# EasyEDA schematic SCH_Aladdin Flight Controller FC-H7_EasyEDA.json

## Sheets
1 STM32H757IIT6: TITLE: STM32H757IIT6 & Power sources; REV: 1.0; Date: 2022-08-20; Sheet: 1/6; Drawn By: Ala BENSAID
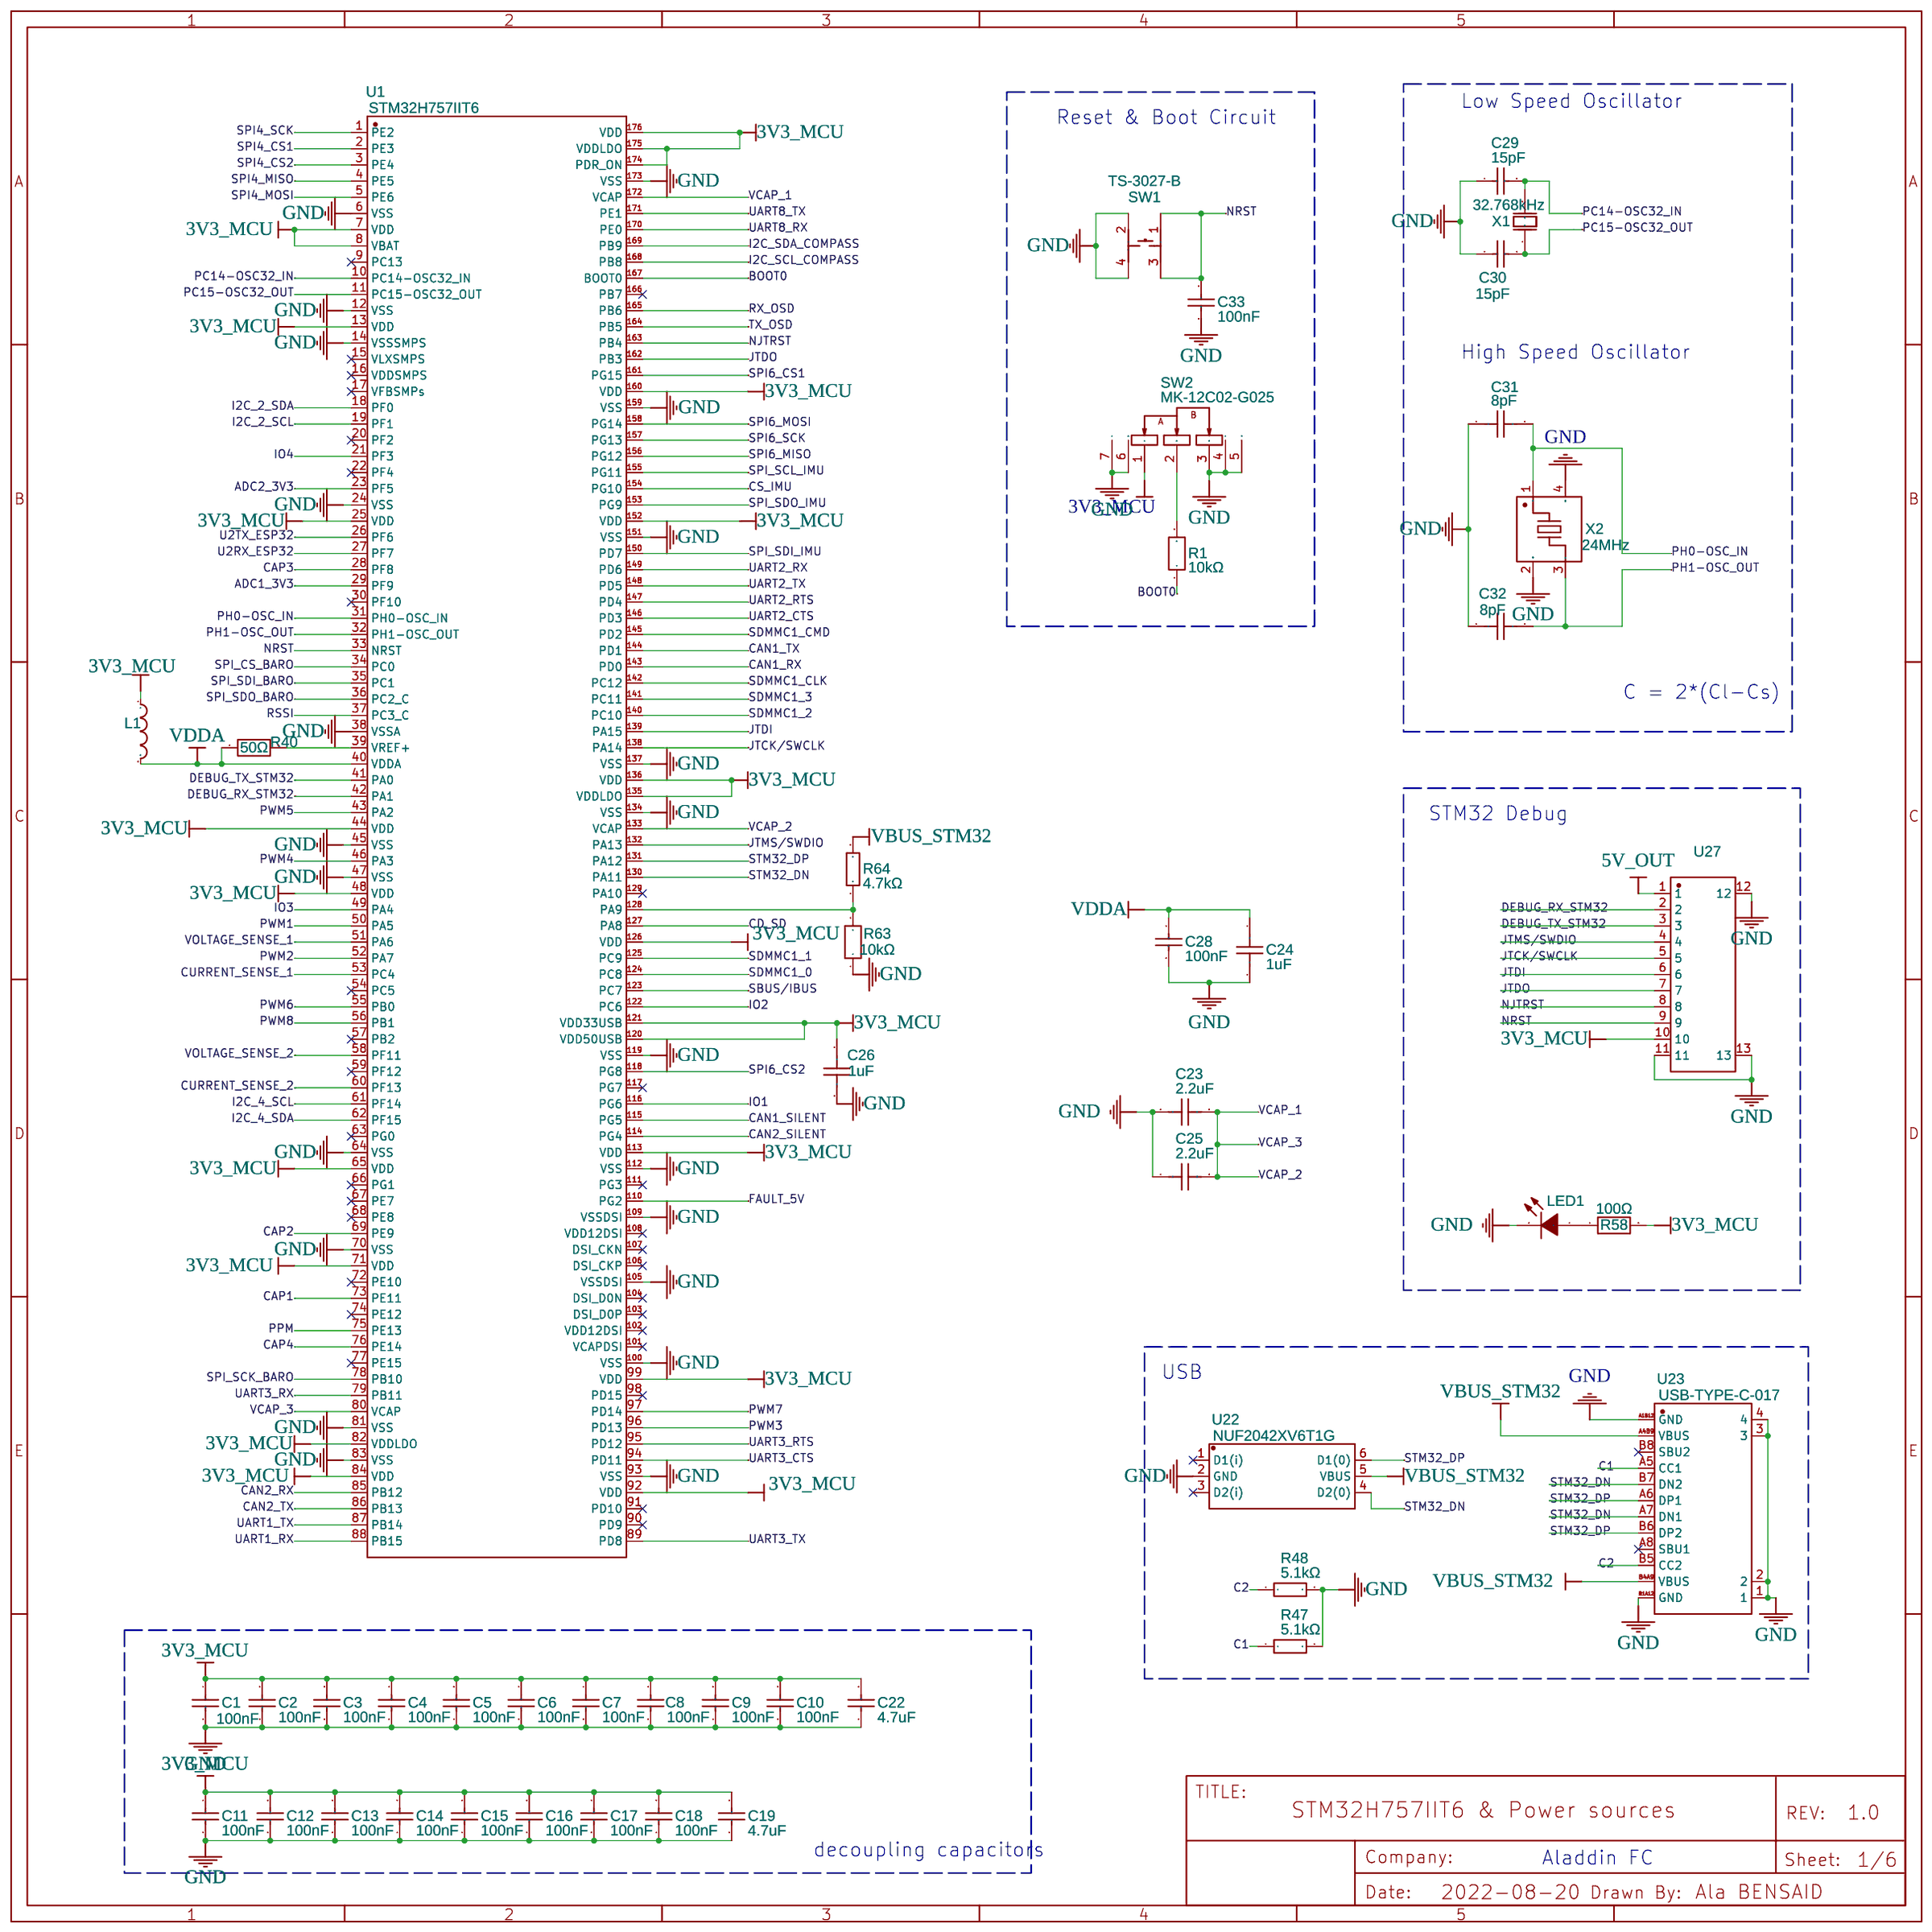
[diagram p0: STM32H757IIT6]
2 On Board Sensor: TITLE: On Board Sensor; Sheet: 2/6
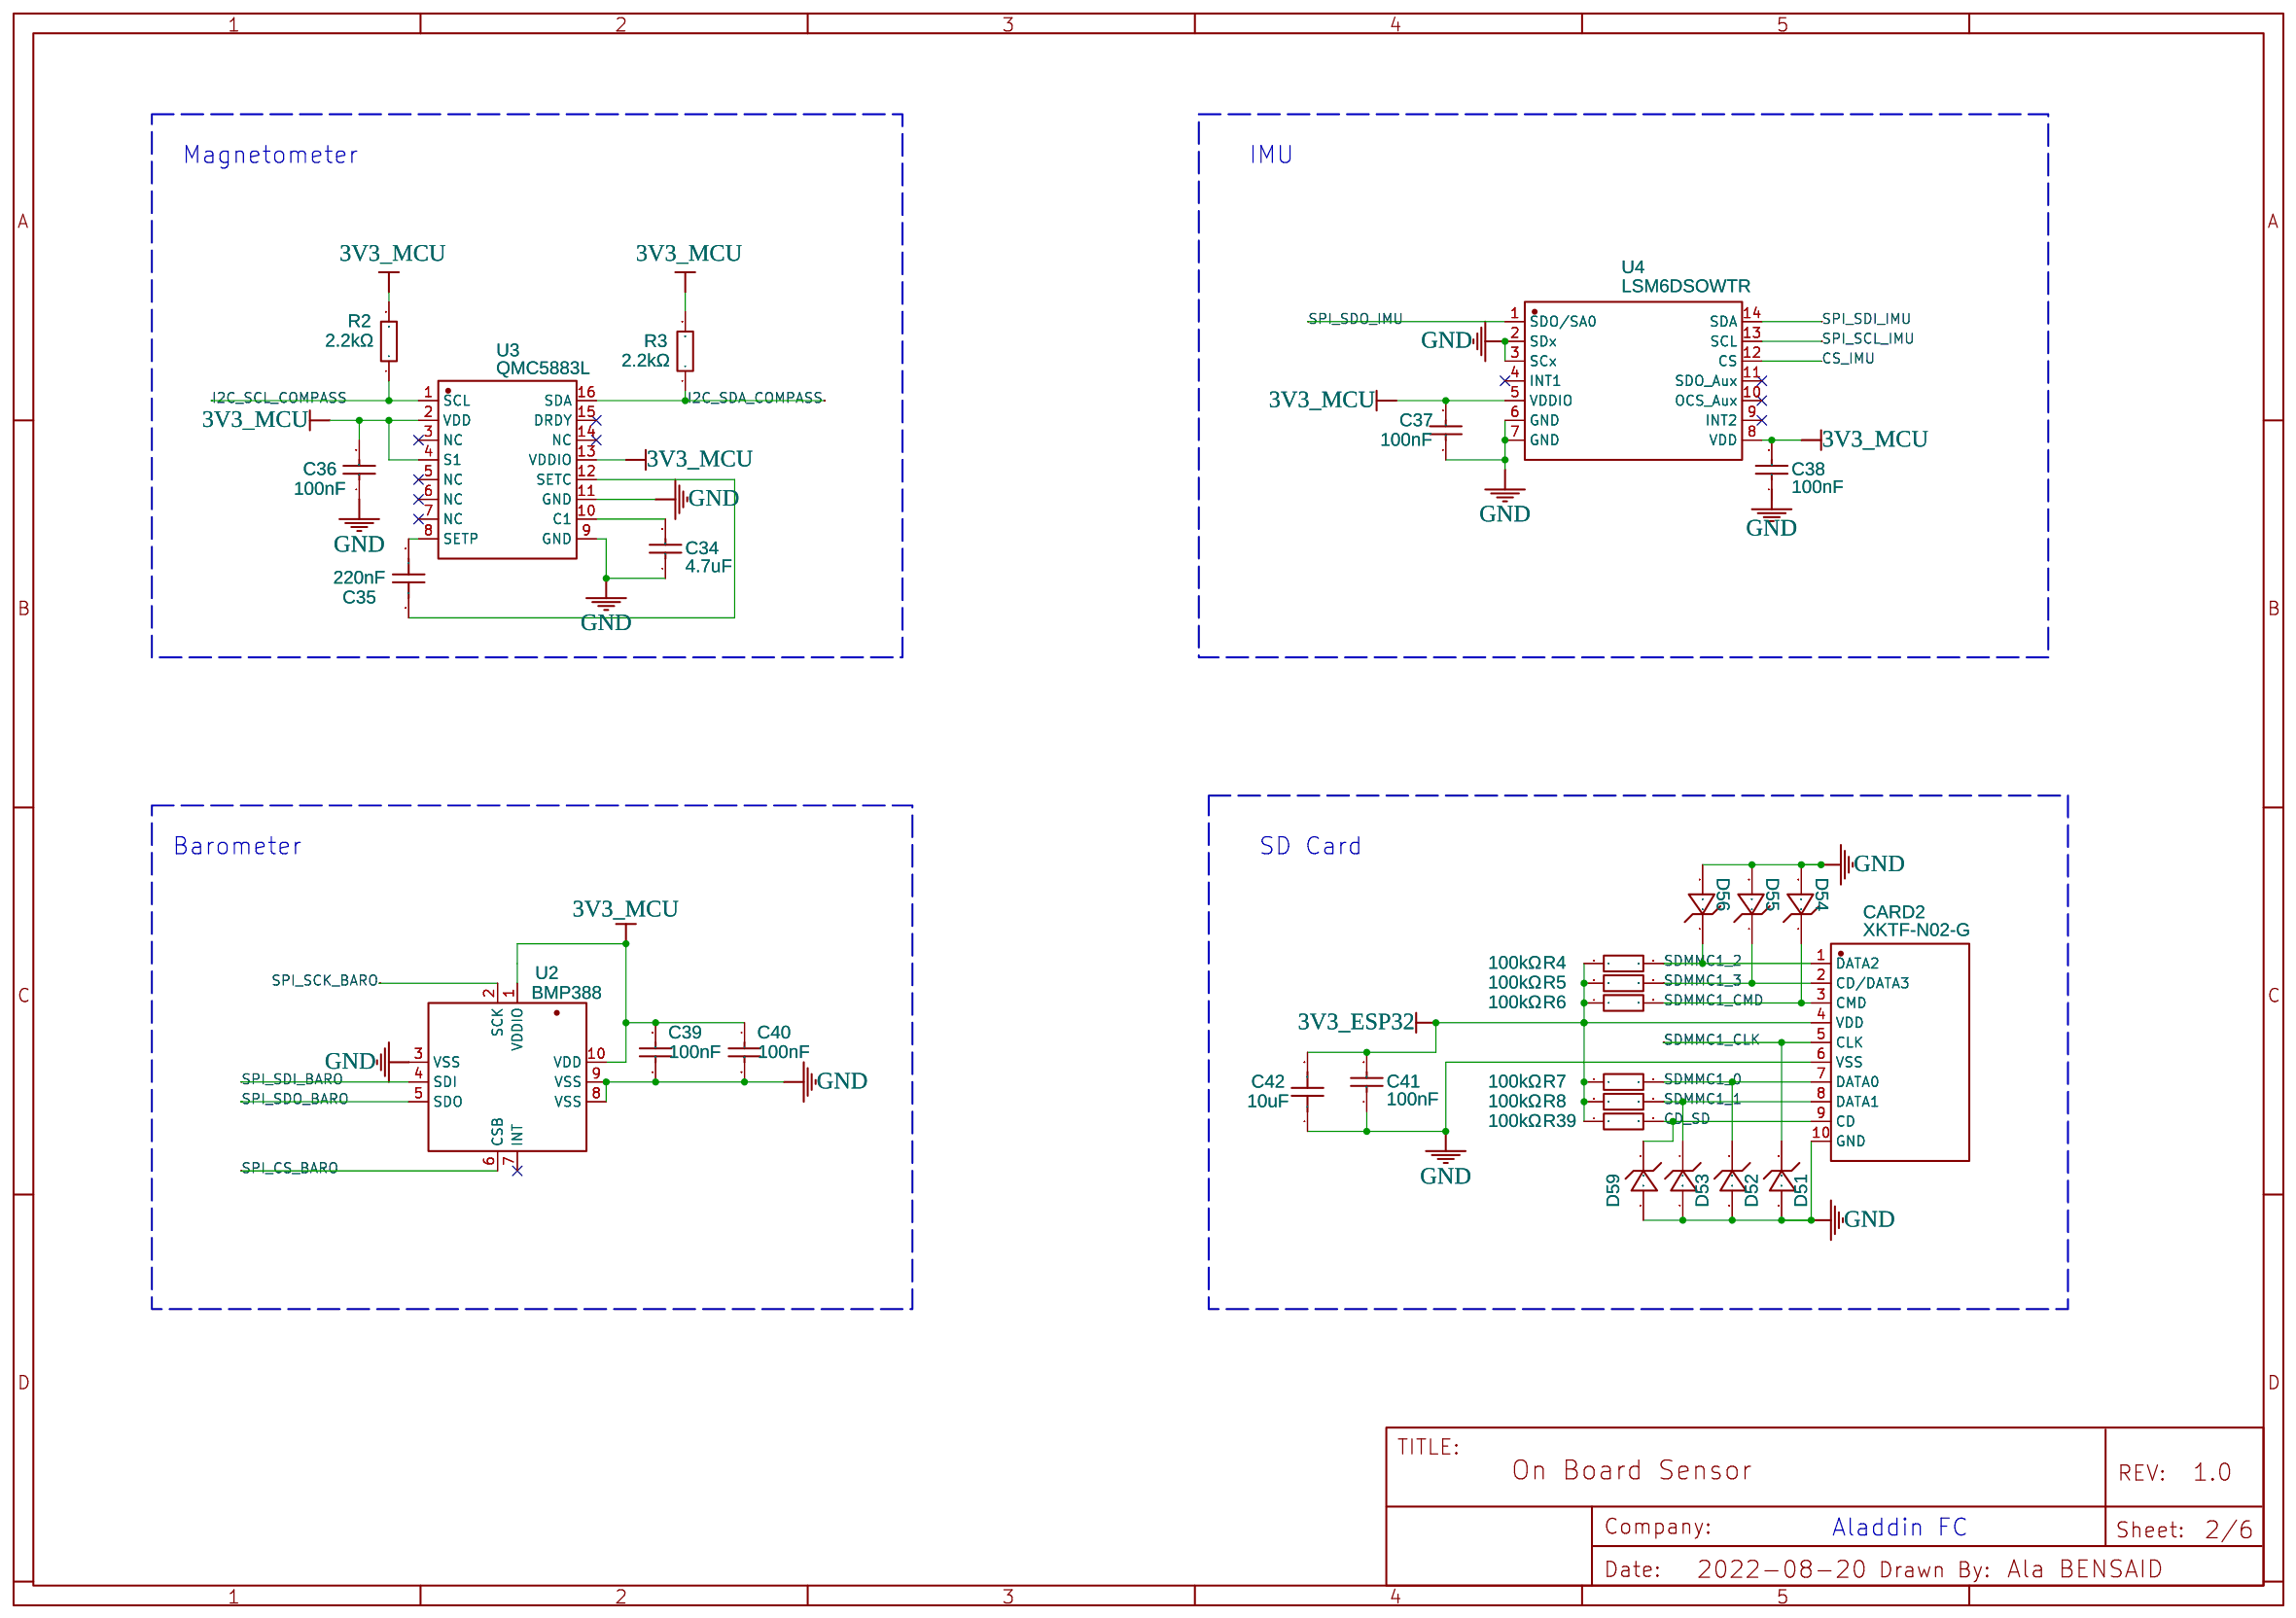
[diagram p1: On Board Sensor]
3 OSD: TITLE: OSD & Atmega328 FMU; Sheet: 3/6
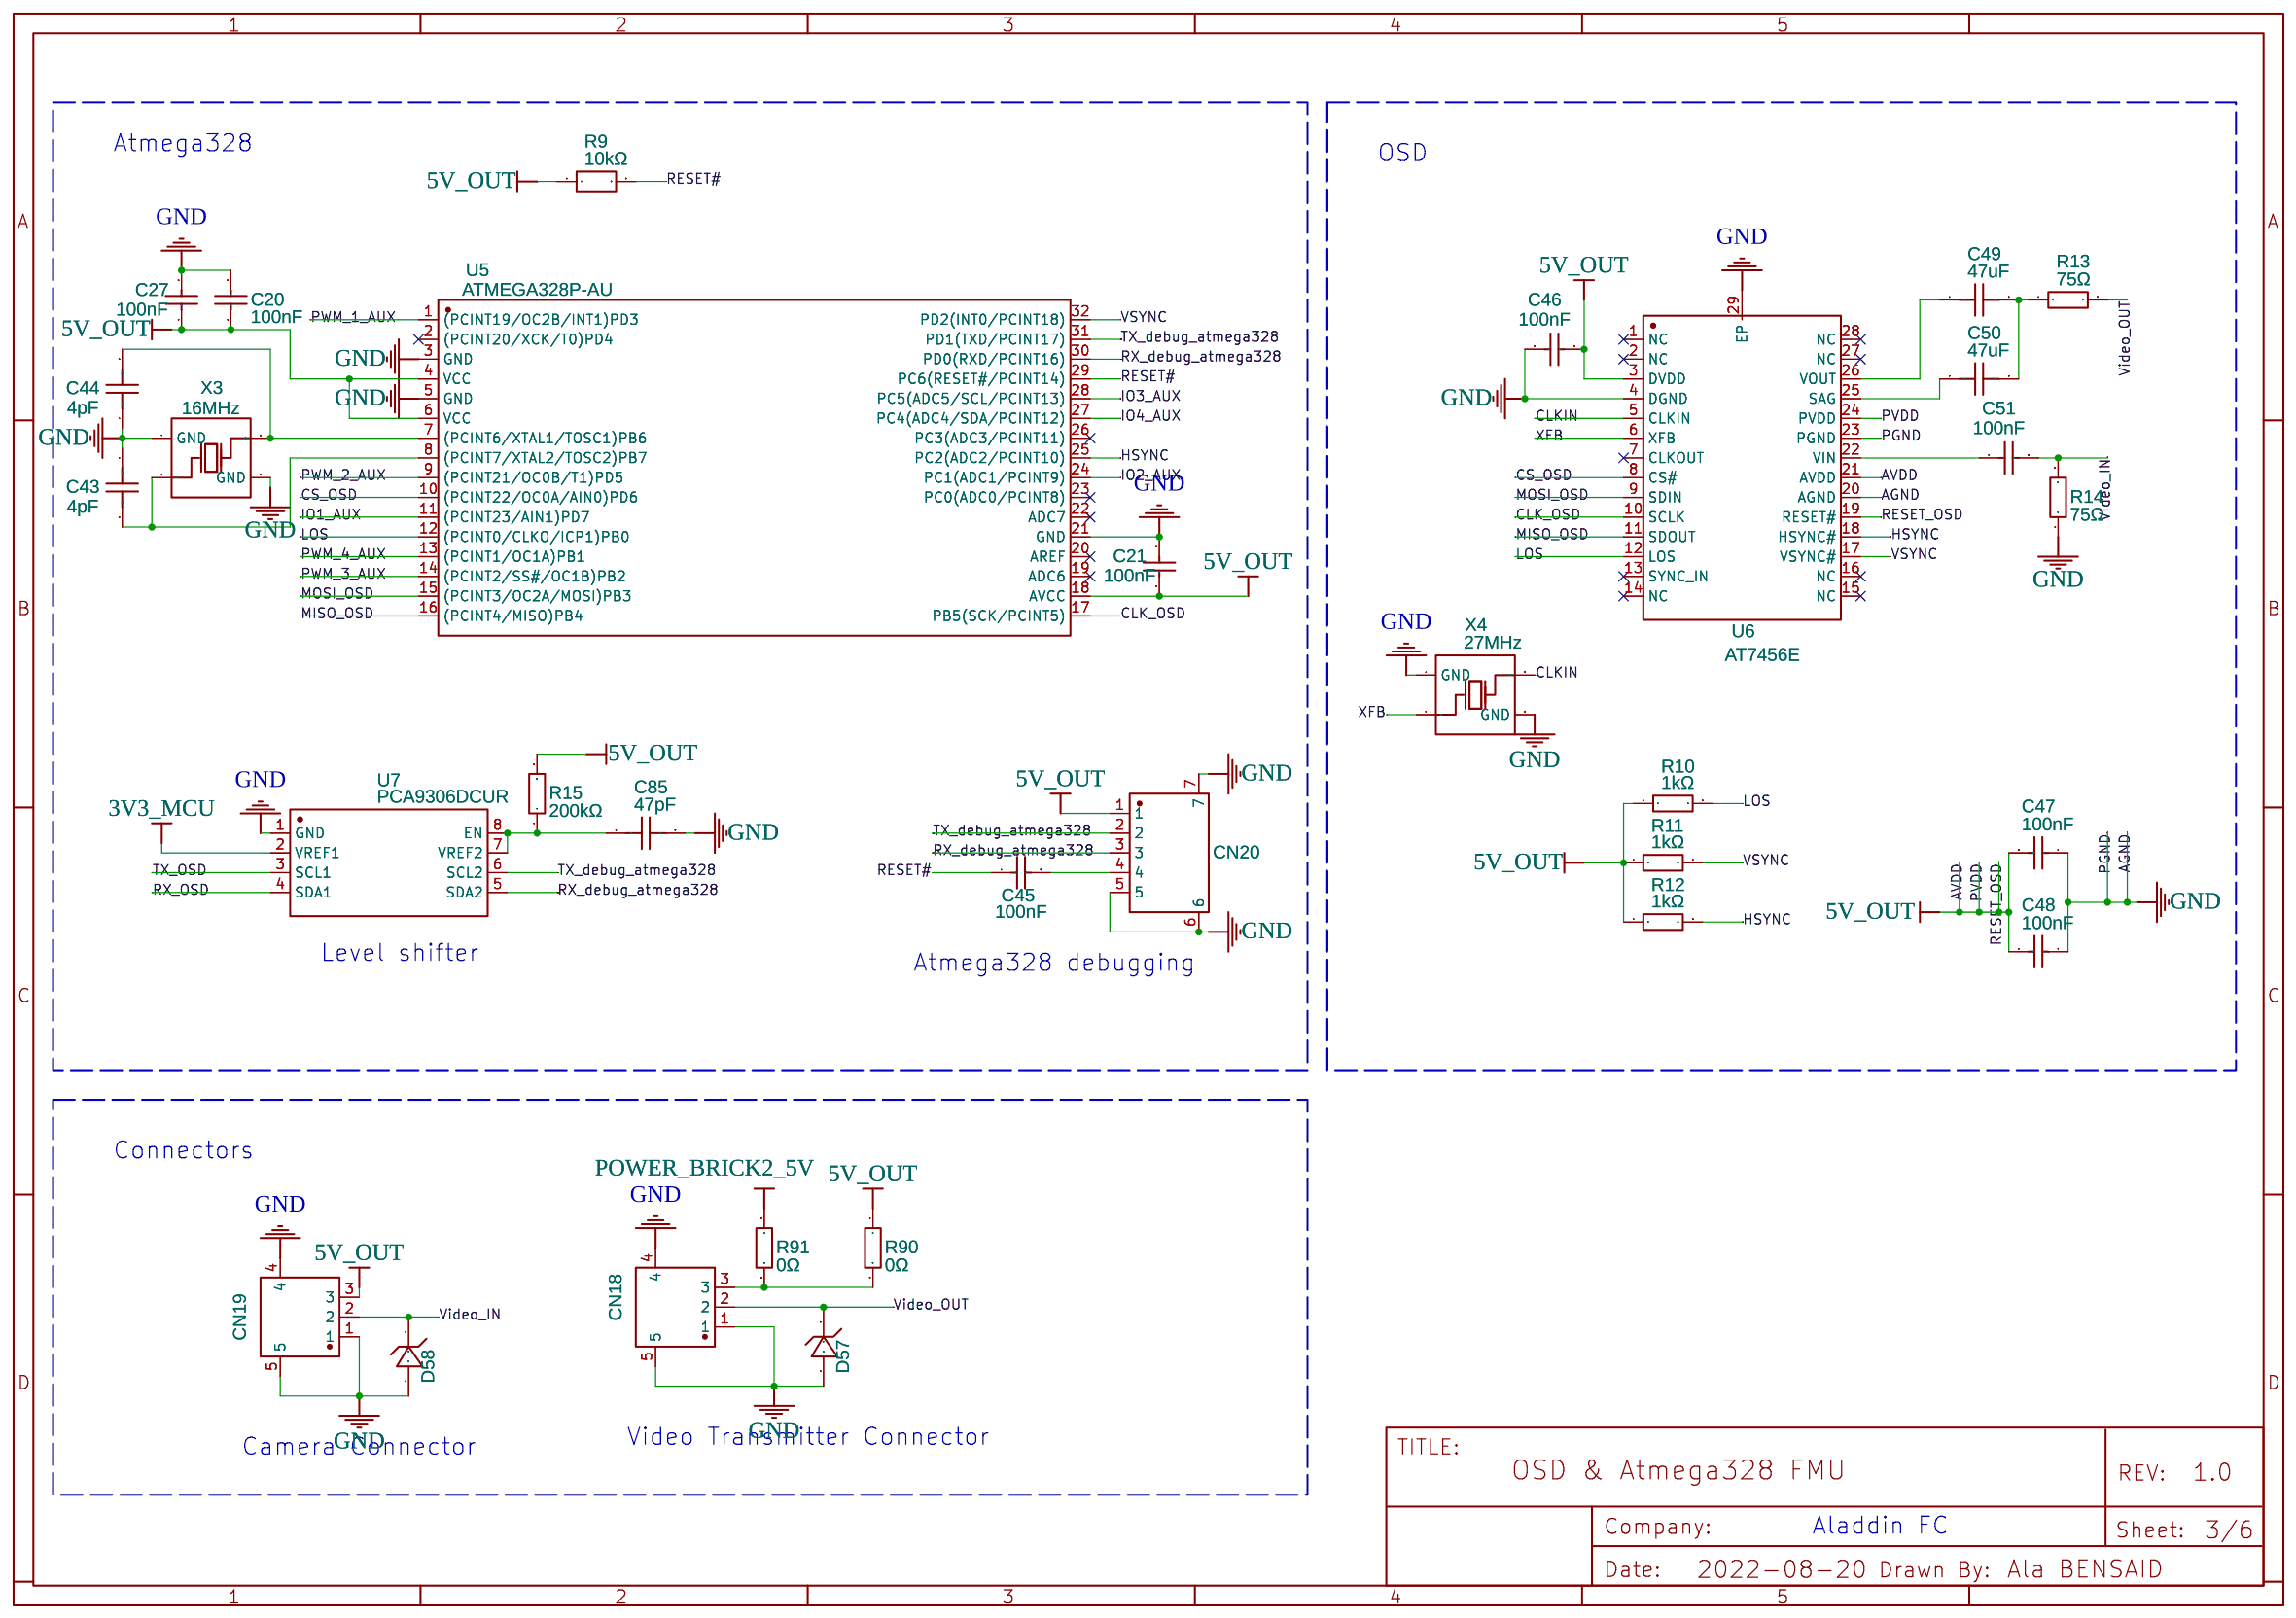
[diagram p2: OSD]
4 Connectors: TITLE: Connectors; Sheet: 4/6
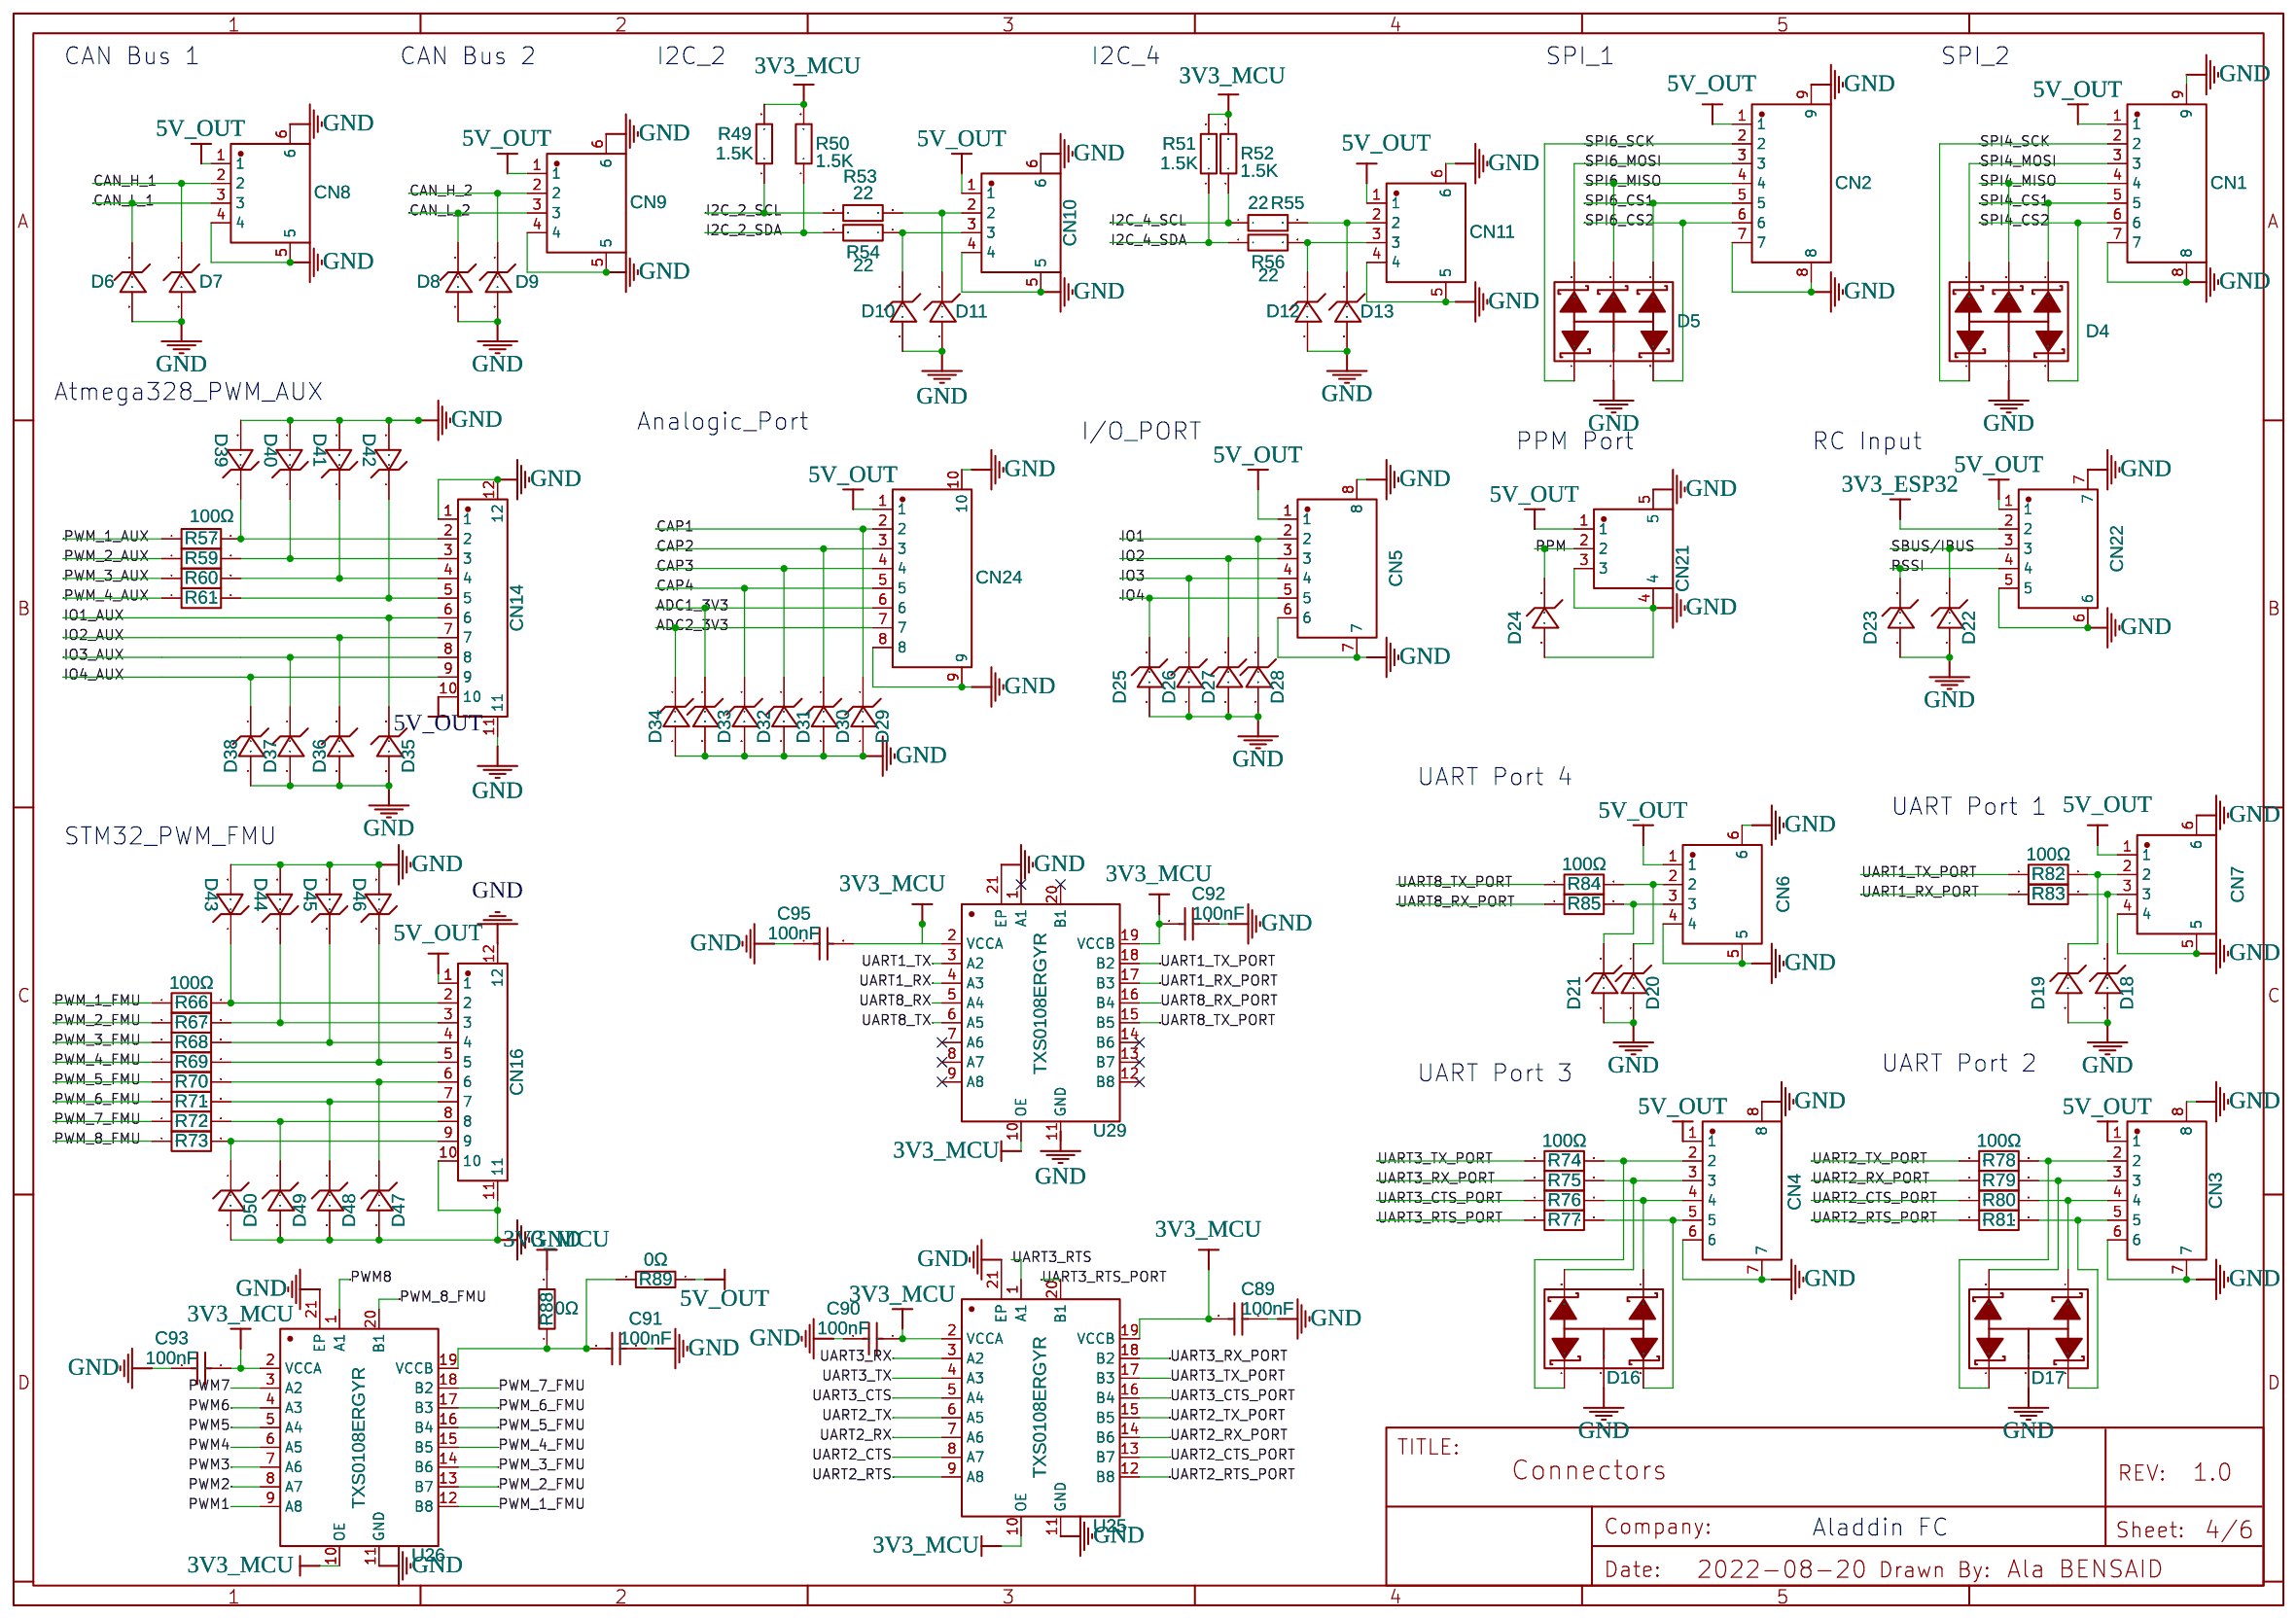
[diagram p3: Connectors]
5 WIFI ESP32: TITLE: WIFI    ESP32; Date: 2022-10-03; Sheet: 5/6
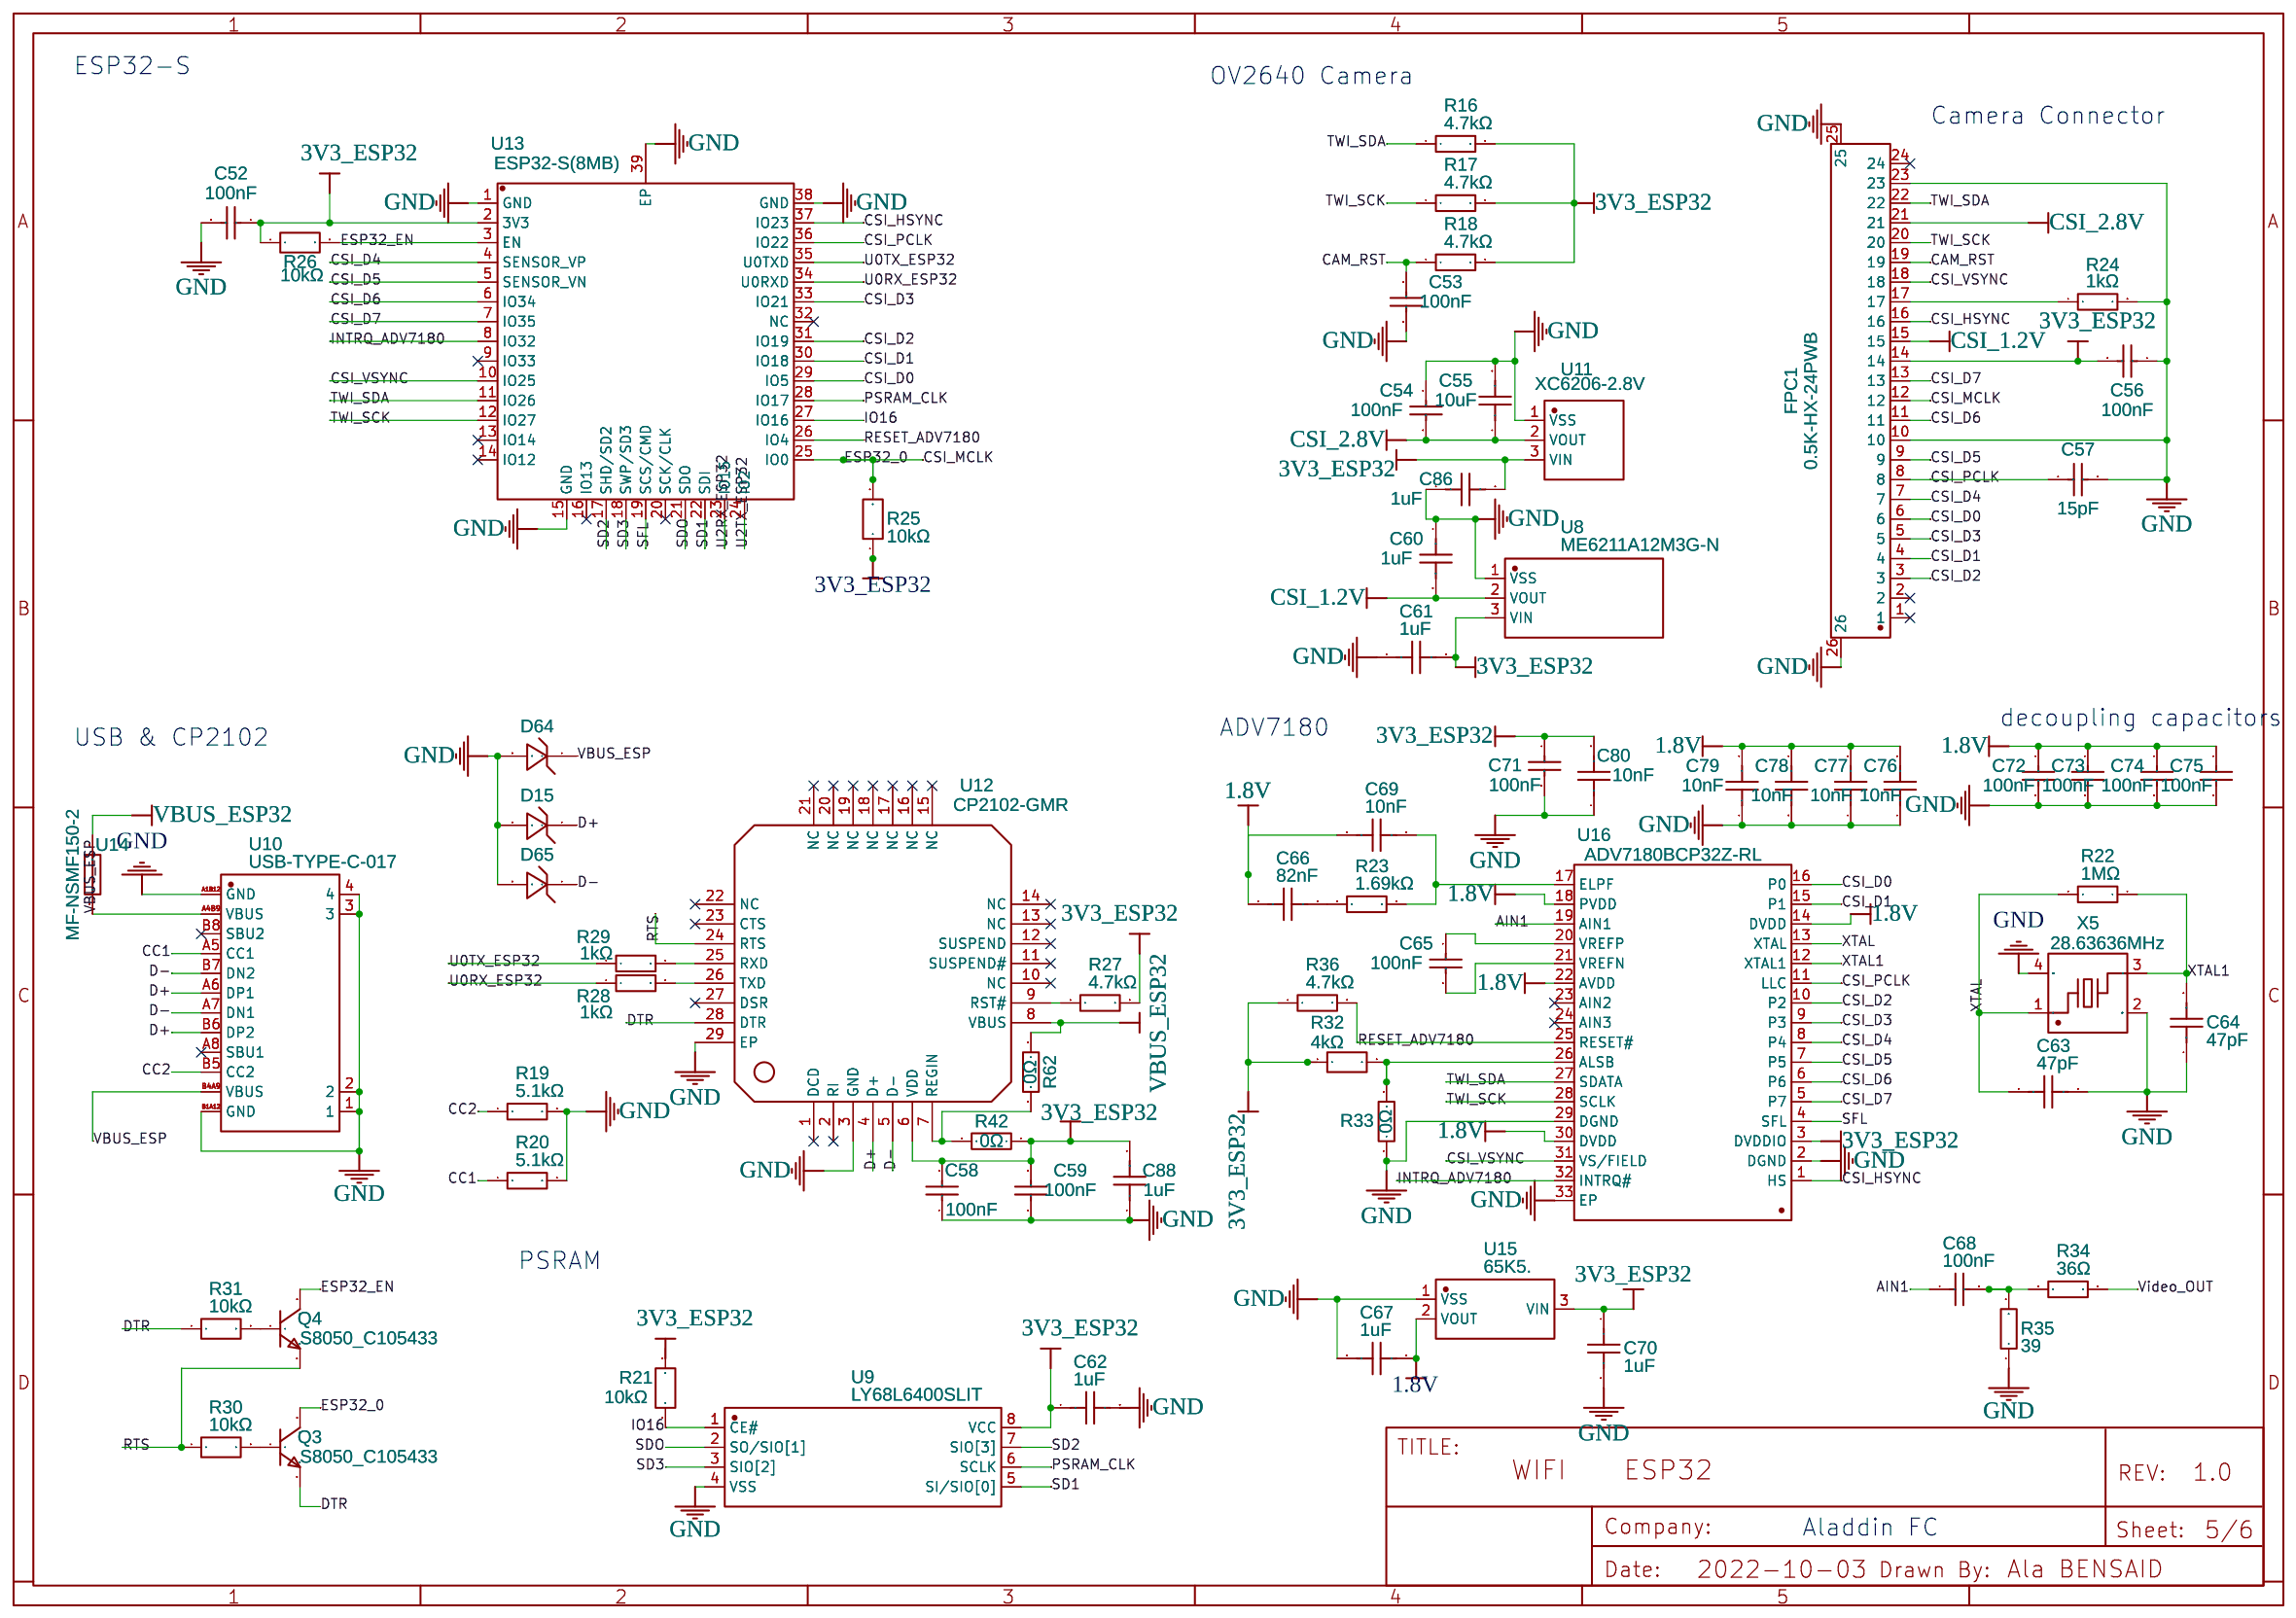
[diagram p4: WIFI ESP32]
6 Power & CAN bus: TITLE: Power & CAN bus; Date: 2022-10-29; Sheet: 6/6
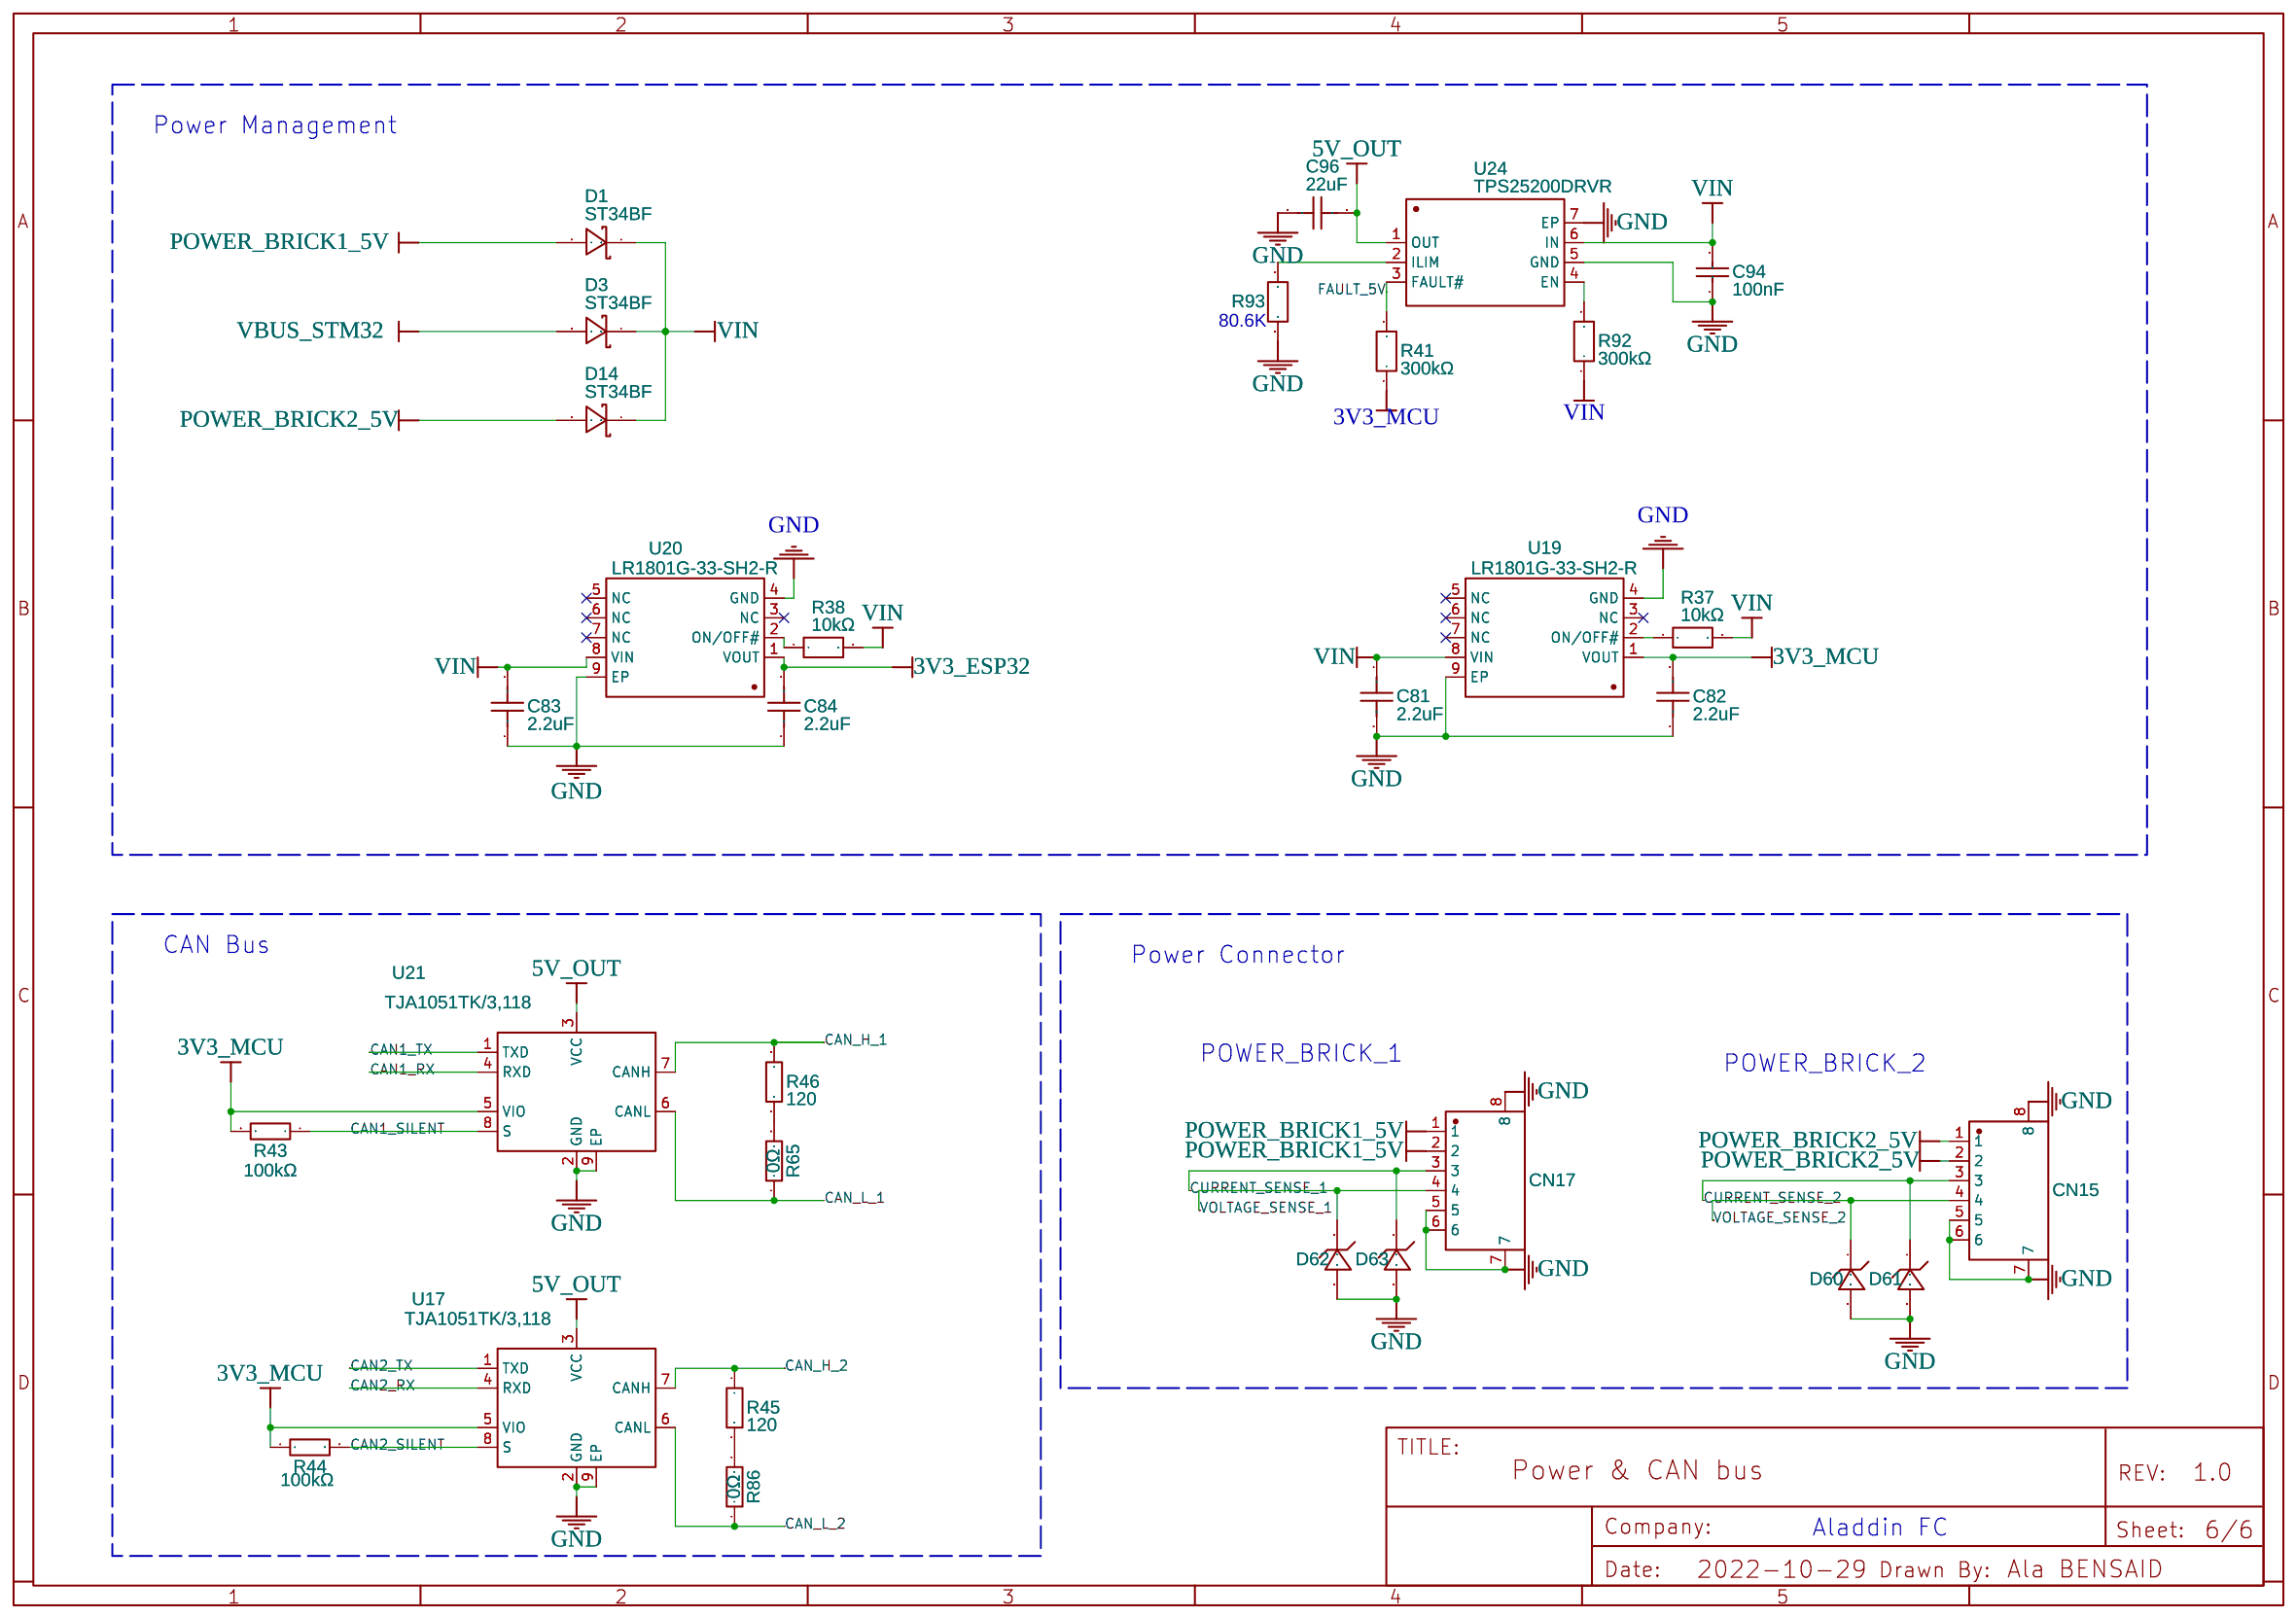
[diagram p5: Power & CAN bus]

## Parts
sheet Connectors
C89  100nF  [C0805]
C90  100nF  [C0805]
C91  100nF  [C0805]
C92  100nF  [C0805]
C93  100nF  [C0805]
C95  100nF  [C0805]
CN1  A1257WV-S-7P  [CONN-SMD_A1257WV-S-7P]
CN2  A1257WV-S-7P  [CONN-SMD_A1257WV-S-7P]
CN3  A1257WV-S-6P  [CONN-SMD_A1257WV-S-6P]
CN4  A1257WV-S-6P  [CONN-SMD_A1257WV-S-6P]
CN5  A1257WV-S-6P  [CONN-SMD_A1257WV-S-6P]
CN6  A1257WV-S-4P  [CONN-SMD_A1257WV-S-4P]
CN7  A1257WV-S-4P  [CONN-SMD_A1257WV-S-4P]
CN8  A1257WV-S-4P  [CONN-SMD_A1257WV-S-4P]
CN9  A1257WV-S-4P  [CONN-SMD_A1257WV-S-4P]
CN10  A1257WV-S-4P  [CONN-SMD_A1257WV-S-4P]
CN11  A1257WV-S-4P  [CONN-SMD_A1257WV-S-4P]
CN14  GH125-S10CCA-00  [CONN-SMD_10P-P1.25_JS_GH125-S10CCA-00]
CN16  GH125-S10CCA-00  [CONN-SMD_10P-P1.25_JS_GH125-S10CCA-00]
CN21  A1257WR-S-3P  [CONN-SMD_A1257WR-S-3P]
CN22  A1257WR-S-5P  [CONN-SMD_A1257WR-S-5P]
CN24  A1257WR-S-8P  [CONN-SMD_A1257WR-S-8P]
D4  SP1001-05JTG  [SC-70-6_L2.2-W1.3-P0.65-LS2.1-BL]
D5  SP1001-05JTG  [SC-70-6_L2.2-W1.3-P0.65-LS2.1-BL]
D6  ESD9X5V-2/TR  [FBP-02C_L1.0-W0.6-RD]
D7  ESD9X5V-2/TR  [FBP-02C_L1.0-W0.6-RD]
D8  ESD9X5V-2/TR  [FBP-02C_L1.0-W0.6-RD]
D9  ESD9X5V-2/TR  [FBP-02C_L1.0-W0.6-RD]
D10  ESD9X5V-2/TR  [FBP-02C_L1.0-W0.6-RD]
D11  ESD9X5V-2/TR  [FBP-02C_L1.0-W0.6-RD]
D12  ESD9X5V-2/TR  [FBP-02C_L1.0-W0.6-RD]
D13  ESD9X5V-2/TR  [FBP-02C_L1.0-W0.6-RD]
D16  SP1001-04JTG  [SC-70-5_L2.1-W1.3-P0.65-LS2.2-BR]
D17  SP1001-04JTG  [SC-70-5_L2.1-W1.3-P0.65-LS2.2-BR]
D18  ESD9X5V-2/TR  [FBP-02C_L1.0-W0.6-RD]
D19  ESD9X5V-2/TR  [FBP-02C_L1.0-W0.6-RD]
D20  ESD9X5V-2/TR  [FBP-02C_L1.0-W0.6-RD]
D21  ESD9X5V-2/TR  [FBP-02C_L1.0-W0.6-RD]
D22  ESD9X5V-2/TR  [FBP-02C_L1.0-W0.6-RD]
D23  ESD9X5V-2/TR  [FBP-02C_L1.0-W0.6-RD]
D24  ESD9X5V-2/TR  [FBP-02C_L1.0-W0.6-RD]
D25  ESD9X5V-2/TR  [FBP-02C_L1.0-W0.6-RD]
D26  ESD9X5V-2/TR  [FBP-02C_L1.0-W0.6-RD]
D27  ESD9X5V-2/TR  [FBP-02C_L1.0-W0.6-RD]
D28  ESD9X5V-2/TR  [FBP-02C_L1.0-W0.6-RD]
D29  ESD9X5V-2/TR  [FBP-02C_L1.0-W0.6-RD]
D30  ESD9X5V-2/TR  [FBP-02C_L1.0-W0.6-RD]
D31  ESD9X5V-2/TR  [FBP-02C_L1.0-W0.6-RD]
D32  ESD9X5V-2/TR  [FBP-02C_L1.0-W0.6-RD]
D33  ESD9X5V-2/TR  [FBP-02C_L1.0-W0.6-RD]
D34  ESD9X5V-2/TR  [FBP-02C_L1.0-W0.6-RD]
D35  ESD9X5V-2/TR  [FBP-02C_L1.0-W0.6-RD]
D36  ESD9X5V-2/TR  [FBP-02C_L1.0-W0.6-RD]
D37  ESD9X5V-2/TR  [FBP-02C_L1.0-W0.6-RD]
D38  ESD9X5V-2/TR  [FBP-02C_L1.0-W0.6-RD]
D39  ESD9X5V-2/TR  [FBP-02C_L1.0-W0.6-RD]
D40  ESD9X5V-2/TR  [FBP-02C_L1.0-W0.6-RD]
D41  ESD9X5V-2/TR  [FBP-02C_L1.0-W0.6-RD]
D42  ESD9X5V-2/TR  [FBP-02C_L1.0-W0.6-RD]
D43  ESD9X5V-2/TR  [FBP-02C_L1.0-W0.6-RD]
D44  ESD9X5V-2/TR  [FBP-02C_L1.0-W0.6-RD]
D45  ESD9X5V-2/TR  [FBP-02C_L1.0-W0.6-RD]
D46  ESD9X5V-2/TR  [FBP-02C_L1.0-W0.6-RD]
D47  ESD9X5V-2/TR  [FBP-02C_L1.0-W0.6-RD]
D48  ESD9X5V-2/TR  [FBP-02C_L1.0-W0.6-RD]
D49  ESD9X5V-2/TR  [FBP-02C_L1.0-W0.6-RD]
D50  ESD9X5V-2/TR  [FBP-02C_L1.0-W0.6-RD]
R49  1.5K  [R0805]
R50  1.5K  [R0805]
R51  1.5K  [R0805]
R52  1.5K  [R0805]
R53  22  [R0805]
R54  22  [R0805]
R55  22  [R0805]
R56  22  [R0805]
R57  100Ω  [R0603]
R59  100Ω  [R0603]
R60  100Ω  [R0603]
R61  100Ω  [R0603]
R66  100Ω  [R0603]
R67  100Ω  [R0603]
R68  100Ω  [R0603]
R69  100Ω  [R0603]
R70  100Ω  [R0603]
R71  100Ω  [R0603]
R72  100Ω  [R0603]
R73  100Ω  [R0603]
R74  100Ω  [R0603]
R75  100Ω  [R0603]
R76  100Ω  [R0603]
R77  100Ω  [R0603]
R78  100Ω  [R0603]
R79  100Ω  [R0603]
R80  100Ω  [R0603]
R81  100Ω  [R0603]
R82  100Ω  [R0603]
R83  100Ω  [R0603]
R84  100Ω  [R0603]
R85  100Ω  [R0603]
R88  0Ω  [R0805]
R89  0Ω  [R0805]
U25  TXS0108ERGYR  [VQFN-20_L4.6-W3.6-P0.50-BL-EP]
U26  TXS0108ERGYR  [VQFN-20_L4.6-W3.6-P0.50-BL-EP]
U29  TXS0108ERGYR  [VQFN-20_L4.6-W3.6-P0.50-BL-EP]
sheet On Board Sensor
C34  4.7uF  [C0805]
C35  220nF  [C0805]
C36  100nF  [C0805]
C37  100nF  [C0805]
C38  100nF  [C0805]
C39  100nF  [C0805]
C40  100nF  [C0805]
C41  100nF  [C0805]
C42  10uF  [C0805]
CARD2  XKTF-N02-G  [TF-SMD_XKTF-N02-G]
D51  ESD9X5V-2/TR  [FBP-02C_L1.0-W0.6-RD]
D52  ESD9X5V-2/TR  [FBP-02C_L1.0-W0.6-RD]
D53  ESD9X5V-2/TR  [FBP-02C_L1.0-W0.6-RD]
D54  ESD9X5V-2/TR  [FBP-02C_L1.0-W0.6-RD]
D55  ESD9X5V-2/TR  [FBP-02C_L1.0-W0.6-RD]
D56  ESD9X5V-2/TR  [FBP-02C_L1.0-W0.6-RD]
D59  ESD9X5V-2/TR  [FBP-02C_L1.0-W0.6-RD]
R2  2.2kΩ  [R0805]
R3  2.2kΩ  [R0805]
R4  100kΩ  [R0805]
R5  100kΩ  [R0805]
R6  100kΩ  [R0805]
R7  100kΩ  [R0805]
R8  100kΩ  [R0805]
R39  100kΩ  [R0805]
U2  BMP388  [SENSORM-SMD_BMP388]
U3  QMC5883L  [LGA-16_L3.0-W3.0-P0.50-BL_SQ]
U4  LSM6DSOWTR  [LGA-14L_L3.0-W2.5-P0.50-TL]
sheet OSD
C20  100nF  [C0805]
C21  100nF  [C0805]
C27  100nF  [C0805]
C43  4pF  [C0805]
C44  4pF  [C0805]
C45  100nF  [C0805]
C46  100nF  [C0805]
C47  100nF  [C0805]
C48  100nF  [C0805]
C49  47uF  [C0805]
C50  47uF  [C0805]
C51  100nF  [C0805]
C85  47pF  [C0805]
CN18  A1257WR-S-3P  [CONN-SMD_A1257WR-S-3P]
CN19  A1257WR-S-3P  [CONN-SMD_A1257WR-S-3P]
CN20  A1257WR-S-5P  [CONN-SMD_A1257WR-S-5P]
D57  ESD9X5V-2/TR  [FBP-02C_L1.0-W0.6-RD]
D58  ESD9X5V-2/TR  [FBP-02C_L1.0-W0.6-RD]
R9  10kΩ  [R0805]
R10  1kΩ  [R0805]
R11  1kΩ  [R0805]
R12  1kΩ  [R0805]
R13  75Ω  [R0805]
R14  75Ω  [R0805]
R15  200kΩ  [R0805]
R90  0Ω  [R0805]
R91  0Ω  [R0805]
U5  ATMEGA328P-AU  [TQFP-32_L7.0-W7.0-P0.80-LS9.0-BL]
U6  AT7456E  [TSSOP-28_L9.7-W4.4-P0.65-LS6.4-BL-EP-2]
U7  PCA9306DCUR  [SSOP-8_L2.0-W2.3-P0.50-LS3.1-BR]
X3  16MHz  [CRYSTAL-SMD_4P-L3.2-W2.5-BL]
X4  27MHz  [OSC-SMD_4P-L2.5-W2.0-BL]
sheet Power & CAN bus
C81  2.2uF  [C0805]
C82  2.2uF  [C0805]
C83  2.2uF  [C0805]
C84  2.2uF  [C0805]
C94  100nF  [C0805]
C96  22uF  [C0805]
CN15  A1257WV-S-6P  [CONN-SMD_A1257WV-S-6P]
CN17  A1257WV-S-6P  [CONN-SMD_A1257WV-S-6P]
D1  ST34BF  [SMBF_L4.3-W3.6-LS5.3-RD]
D3  ST34BF  [SMBF_L4.3-W3.6-LS5.3-RD]
D14  ST34BF  [SMBF_L4.3-W3.6-LS5.3-RD]
D60  ESD9X5V-2/TR  [FBP-02C_L1.0-W0.6-RD]
D61  ESD9X5V-2/TR  [FBP-02C_L1.0-W0.6-RD]
D62  ESD9X5V-2/TR  [FBP-02C_L1.0-W0.6-RD]
D63  ESD9X5V-2/TR  [FBP-02C_L1.0-W0.6-RD]
R37  10kΩ  [R0805]
R38  10kΩ  [R0805]
R41  300kΩ  [R0805]
R43  100kΩ  [R0805]
R44  100kΩ  [R0805]
R45  120  [R0805]
R46  120  [R0805]
R65  0Ω  [R0805]
R86  0Ω  [R0805]
R92  300kΩ  [R0805]
R93  RC0805DR-0780K6L  [R0805]
U17  TJA1051TK/3,118  [HVSON-8_L3.0-W3.0-P0.65-BL-EP]
U19  LR1801G-33-SH2-R  [HSOP-8_L5.0-W4.0-P1.27-LS6.2-BL-EP]
U20  LR1801G-33-SH2-R  [HSOP-8_L5.0-W4.0-P1.27-LS6.2-BL-EP]
U21  TJA1051TK/3,118  [HVSON-8_L3.0-W3.0-P0.65-BL-EP]
U24  TPS25200DRVR  [WSON-6_L2.0-W2.0-P0.65-TL-EP]
sheet STM32H757IIT6
C1  100nF  [C0805]
C2  100nF  [C0805]
C3  100nF  [C0805]
C4  100nF  [C0805]
C5  100nF  [C0805]
C6  100nF  [C0805]
C7  100nF  [C0805]
C8  100nF  [C0805]
C9  100nF  [C0805]
C10  100nF  [C0805]
C11  100nF  [C0805]
C12  100nF  [C0805]
C13  100nF  [C0805]
C14  100nF  [C0805]
C15  100nF  [C0805]
C16  100nF  [C0805]
C17  100nF  [C0805]
C18  100nF  [C0805]
C19  4.7uF  [C0805]
C22  4.7uF  [C0805]
C23  2.2uF  [C0805]
C24  1uF  [C0805]
C25  2.2uF  [C0805]
C26  1uF  [C0805]
C28  100nF  [C0805]
C29  15pF  [C0603]
C30  15pF  [C0603]
C31  8pF  [C0805]
C32  8pF  [C0805]
C33  100nF  [C0805]
L1  FCM1005KF-601T03  [L0402]
LED1  SZYY0805B  [LED0805-R-RD_BLUE]
R1  10kΩ  [R0805]
R40  50Ω  [R0805]
R47  5.1kΩ  [R0402]
R48  5.1kΩ  [R0402]
R58  100Ω  [R0603]
R63  10kΩ  [R0805]
R64  4.7kΩ  [R0805]
SW1  TS-3027-B  [SW-SMD_4P-L3.0-W2.8-P1.65-TL_GT-TS171A-H014-L1]
SW2  MK-12C02-G025  [SW-SMD_MK-12C02-G025]
U1  STM32H757IIT6  [LQFP-176_L24.0-W24.0-P0.50-LS26.0-BL]
U22  NUF2042XV6T1G  [SOT-563_L1.6-W1.2-P0.50-LS1.6-TL]
U23  USB-TYPE-C-017  [USB-TYPE-C-SMD_C9900008089_ALA1]
U27  A1257WR-S-11P  [CONN-SMD_A1257WR-S-11P]
X1  32.768kHz  [OSC-SMD_2P-L3.2-W1.5]
X2  24MHz  [OSC-SMD_4P-L2.0-W1.6-BL]
sheet WIFI ESP32
C52  100nF  [C0805]
C53  100nF  [C0805]
C54  100nF  [C0805]
C55  10uF  [C0805]
C56  100nF  [C0805]
C57  15pF  [C0805]
C58  100nF  [C0805]
C59  100nF  [C0805]
C60  1uF  [C0805]
C61  1uF  [C0805]
C62  1uF  [C0805]
C63  47pF  [C0805]
C64  47pF  [C0805]
C65  100nF  [C0805]
C66  82nF  [C0805]
C67  1uF  [C0805]
C68  100nF  [C0805]
C69  10nF  [C0805]
C70  1uF  [C0805]
C71  100nF  [C0805]
C72  100nF  [C0805]
C73  100nF  [C0805]
C74  100nF  [C0805]
C75  100nF  [C0805]
C76  10nF  [C0805]
C77  10nF  [C0805]
C78  10nF  [C0805]
C79  10nF  [C0805]
C80  10nF  [C0805]
C86  1uF  [C0805]
C88  1uF  [C0805]
D15  ESD9X5V-2/TR  [FBP-02C_L1.0-W0.6-RD]
D64  ESD9X5V-2/TR  [FBP-02C_L1.0-W0.6-RD]
D65  ESD9X5V-2/TR  [FBP-02C_L1.0-W0.6-RD]
FPC1  0.5K-HX-24PWB  [FPC-SMD_24P-P0.50_HDGC_0.5K-HX-24PWB]
Q3  S8050_C105433  [SOT-23-3_L2.9-W1.6-P1.90-LS2.8-BR]
Q4  S8050_C105433  [SOT-23-3_L2.9-W1.6-P1.90-LS2.8-BR]
R16  4.7kΩ  [R0805]
R17  4.7kΩ  [R0805]
R18  4.7kΩ  [R0805]
R19  5.1kΩ  [R0402]
R20  5.1kΩ  [R0402]
R21  10kΩ  [R0805]
R22  1MΩ  [R0805]
R23  1.69kΩ  [R0805]
R24  1kΩ  [R0805]
R25  10kΩ  [R0805]
R26  10kΩ  [R0805]
R27  4.7kΩ  [R0805]
R28  1kΩ  [R0805]
R29  1kΩ  [R0805]
R30  10kΩ  [R0805]
R31  10kΩ  [R0805]
R32  4kΩ  [R0805]
R33  0Ω  [R0805]
R34  36Ω  [R0805]
R35  39  [R0805]
R36  4.7kΩ  [R0805]
R42  0Ω  [R0805]
R62  0Ω  [R0805]
U8  ME6211A12M3G-N  [SOT-23-3_L2.9-W1.6-P1.90-LS2.8-BR]
U9  LY68L6400SLIT  [SOP-8_L4.9-W3.9-P1.27-LS6.0-BL]
U10  USB-TYPE-C-017  [USB-TYPE-C-SMD_C9900008089_ALA1]
U11  XC6206-2.8V  [SOT-23-3_L2.9-W1.6-P1.90-LS2.8-BR]
U12  CP2102-GMR  [WQFN-28_L5.0-W5.0-P0.50-BL-EP3.2]
U13  ESP32-S(8MB)  [WIRELM-SMD_ESP32-S]
U14  MF-NSMF150-2  [F1206]
U15  65K5.  [SOT-23-3_L2.9-W1.3-P1.90-LS2.4-BR]
U16  ADV7180BCP32Z-RL  [LFCSP-32_L5.0-W5.0-P0.50-BL-EP3.6]
X5  28.63636MHz  [CRYSTAL-SMD_4P-L3.2-W2.5-BL]

## Library data of the parts
C1-C18 C20 C21 C27 C28 C33 C36-C41 C45-C48 C51-C54 C56 C58 C59 C65 C68 C71-C75 C89-C95 = CL21B104KBCNNNC: Supplier: LCSC; Manufacturer: SAMSUNG; Supplier Part: C1711; JLCPCB Part Class: Extended Part
CN1 CN2 = A1257WV-S-7P: Supplier: LCSC; Supplier Part: C225123; Manufacturer: Changjiang Connectors; Contributor: LCSC; JLCPCB Part Class: Extended Part
CN3-CN5 CN15 CN17 = A1257WV-S-6P: Supplier: LCSC; Supplier Part: C225122; Manufacturer: CJT(长江连接器); Contributor: LCSC; JLCPCB Part Class: Extended Part
CN6-CN11 = A1257WV-S-4P: Supplier: LCSC; Supplier Part: C225120; Manufacturer: CJT(长江连接器); Contributor: LCSC; JLCPCB Part Class: Extended Part
CN14 CN16 = GH125-S10CCA-00: Supplier: LCSC; Supplier Part: C2886788; Manufacturer: JS(钜硕电子); Contributor: LCSC; JLCPCB Part Class: Extended Part
CN18 CN19 CN21 = A1257WR-S-3P: Supplier: LCSC; Supplier Part: C225126; Manufacturer: Changjiang Connectors; Contributor: LCSC; JLCPCB Part Class: Extended Part
CN20 CN22 = A1257WR-S-5P: Supplier: LCSC; Supplier Part: C225128; Manufacturer: Changjiang Connectors; Contributor: LCSC; JLCPCB Part Class: Extended Part
CN24 = A1257WR-S-8P: Supplier: LCSC; Supplier Part: C225131; Manufacturer: CJT(长江连接器); Contributor: LCSC; JLCPCB Part Class: Extended Part
D4 D5 = SP1001-05JTG: Supplier: LCSC; Supplier Part: C207268; Manufacturer: Littelfuse; Contributor: LCSC; JLCPCB Part Class: Extended Part
D6-D13 D15 D18-D65 = ESD9X5V-2/TR: Supplier: LCSC; Supplier Part: C239552; Manufacturer: Will Semicon; Contributor: LCSC; JLCPCB Part Class: Extended Part
D16 D17 = SP1001-04JTG: Supplier: LCSC; Supplier Part: C207267; Manufacturer: Littelfuse; Contributor: LCSC; JLCPCB Part Class: Extended Part
R49-R52 = CR0805-FX-1501ELF: Supplier: LCSC; Supplier Part: C203762; Manufacturer: BOURNS; Contributor: LCSC; JLCPCB Part Class: Extended Part; Resistance: 1.5kΩ
R53-R56 = CR0805-FX-22R0ELF: Supplier: LCSC; Supplier Part: C204317; Manufacturer: BOURNS; Contributor: LCSC; JLCPCB Part Class: Extended Part; Resistance: 22Ω
R57-R61 R66-R85 = FRC0603J101 TS: Supplier: LCSC; Supplier Part: C2907089; Manufacturer: FOJAN(富捷); Contributor: lcsc; JLCPCB Part Class: Extended Part
R33 R42 R62 R65 R86 R88-R91 = 0805W8F0000T5E: Supplier: LCSC; Manufacturer: UniOhm; Supplier Part: C17477; Resistance (Ohms): 0; JLCPCB Part Class: Basic Part
U25 U26 U29 = TXS0108ERGYR: Supplier: LCSC; Supplier Part: C90706; Manufacturer: TI(德州仪器); Contributor: LCSC; JLCPCB Part Class: Extended Part
C19 C22 C34 = CL21B475KAFNNNE: Supplier: LCSC; Manufacturer: SAMSUNG; Supplier Part: C98195; JLCPCB Part Class: Extended Part
C35 = CC0805ZRY5V8BB224: Supplier: LCSC; Supplier Part: C327192; Manufacturer: YAGEO; Contributor: LCSC; JLCPCB Part Class: Extended Part
C42 C55 = TMK212BBJ106KGHT: Supplier: LCSC; Supplier Part: C386084; Manufacturer: Taiyo Yuden; Contributor: LCSC; JLCPCB Part Class: Extended Part
CARD2 = XKTF-N02-G: Supplier: LCSC; Supplier Part: C1121875; Manufacturer: XKB Connectivity; Contributor: LCSC; JLCPCB Part Class: Extended Part
R2 R3 = AR05BTB2201: Supplier: LCSC; Supplier Part: C374634; Manufacturer: Viking Tech; Resistance (Ohms): 2.2K; Contributor: LCSC; JLCPCB Part Class: Extended Part
R4-R8 R39 R43 R44 = ARG05BTC1003: Supplier: LCSC; Supplier Part: C406726; Manufacturer: Viking Tech; Resistance (Ohms): 100K; Contributor: LCSC; JLCPCB Part Class: Extended Part
U2 = BMP388: Supplier: LCSC; Supplier Part: C779278; Manufacturer: null; JLCPCB Part Class: Extended Part; Contributor: LCSC
U3 = QMC5883L: Supplier: LCSC; Supplier Part: C976032; Manufacturer: QST(上海矽睿); Contributor: LCSC; JLCPCB Part Class: Extended Part
U4 = LSM6DSOWTR: Supplier: LCSC; Supplier Part: C2829074; Manufacturer: ST(意法半导体); link: https://atta.szlcsc.comnull; JLCPCB Part Class: Extended Part; Contributor: lcsc
C43 C44 = TCC0805C0G4R0C500BT: Supplier: LCSC; Supplier Part: C282704; Manufacturer: CCTC; Contributor: LCSC; JLCPCB Part Class: Extended Part
C49 C50 = JMK212BJ476MG-T: Supplier: LCSC; Manufacturer: TAIYO YUDEN; Supplier Part: C87159; JLCPCB Part Class: Extended Part
C63 C64 C85 = GCM21A5C2E470JX01D: Supplier: LCSC; Supplier Part: C440149; Manufacturer: muRata(村田); link: https://atta.szlcsc.com/upload/public/pdf/source/20191022/C440149_79910CCEBA1A5070D97A60AC043D8869.pdf; Contributor: lcsc
R1 R9 R21 R25 R26 R30 R31 R37 R38 R63 = ARG05BTC1002: Supplier: LCSC; Supplier Part: C406725; Manufacturer: Viking Tech; Resistance (Ohms): 10K; Contributor: LCSC; JLCPCB Part Class: Extended Part
R10-R12 R24 R28 R29 = ARG05BTC1001: Supplier: LCSC; Supplier Part: C309081; Manufacturer: Viking Tech; Resistance (Ohms): 1K; Contributor: LCSC; JLCPCB Part Class: Extended Part
R13 R14 = AR05BTDW0750: Supplier: LCSC; Supplier Part: C319469; Manufacturer: Viking Tech; Resistance (Ohms): 75; Contributor: LCSC; JLCPCB Part Class: Extended Part
R15 = AR05BTDW2003: Supplier: LCSC; Supplier Part: C319784; Manufacturer: Viking Tech; Resistance (Ohms): 200K; Contributor: LCSC; JLCPCB Part Class: Extended Part
U5 = ATMEGA328P-AU: Supplier: LCSC; Manufacturer: MICROCHIP; Supplier Part: C14877; JLCPCB Part Class: Basic Part
U6 = AT7456E: Supplier: LCSC; Manufacturer: ZHONGKEWEI; Supplier Part: C82351; JLCPCB Part Class: Extended Part
U7 = PCA9306DCUR: Supplier: LCSC; Manufacturer: TI; Supplier Part: C33196; JLCPCB Part Class: Extended Part
X3 = X1E0003410273: Supplier: LCSC; Supplier Part: C255906; Manufacturer: Seiko Epson; Contributor: LCSC; JLCPCB Part Class: Extended Part
X4 = Q24FA20H00238: Supplier: LCSC; Supplier Part: C255960; Manufacturer: Seiko Epson; Contributor: LCSC; JLCPCB Part Class: Extended Part
C81-C84 = CC0805ZRY5V7BB225: Supplier: LCSC; Supplier Part: C107171; Manufacturer: YAGEO; Contributor: LCSC; JLCPCB Part Class: Extended Part
C96 = CL21A226MAQNNNE: Supplier: LCSC; Manufacturer: SAMSUNG(三星); Supplier Part: C45783; JLCPCB Part Class: Basic Part
D1 D3 D14 = ST34BF: Supplier: LCSC; Supplier Part: C414005; Manufacturer: MDD（Microdiode Electronics）; Contributor: LCSC; JLCPCB Part Class: Extended Part
R41 R92 = ERJ6GEYJ304V: Supplier: LCSC; Supplier Part: C410067; Manufacturer: PANASONIC; Resistance (Ohms): 300K; Contributor: LCSC; JLCPCB Part Class: Extended Part
R45 R46 = AC0805FR-07120RL: Supplier: LCSC; Supplier Part: C228277; Manufacturer: YAGEO; Contributor: LCSC; JLCPCB Part Class: Extended Part; Resistance: 120Ω
R93 = RC0805DR-0780K6L: Supplier: LCSC; Supplier Part: C472215; Manufacturer: YAGEO(国巨); Resistance: 80.6kΩ; JLCPCB Part Class: Extended Part; Contributor: lcsc
U17 U21 = TJA1051TK/3,118: Supplier: LCSC; Manufacturer: NXP; Supplier Part: C124020; JLCPCB Part Class: Extended Part
U19 U20 = LR1801G-33-SH2-R: Supplier: LCSC; Supplier Part: C410479; Manufacturer: Unisonic Tech; Contributor: LCSC; JLCPCB Part Class: Extended Part
U24 = TPS25200DRVR: Supplier: LCSC; Manufacturer: TI; Contributor: LCSC; Supplier Part: C128401; JLCPCB Part Class: Extended Part
C23 C25 = CS2012X5R225K500NRE: Supplier: LCSC; Supplier Part: C513763; Manufacturer: Samwha Capacitor; Contributor: LCSC; JLCPCB Part Class: Extended Part
C24 C26 C60-C62 C67 C70 C86 C88 = UMK212BJ105KG-T: Supplier: LCSC; Supplier Part: C319195; Manufacturer: Taiyo Yuden; Contributor: LCSC; JLCPCB Part Class: Extended Part
C29 C30 = CL10C150JB8NNNC: Supplier: LCSC; Manufacturer: SAMSUNG; Supplier Part: C1644; JLCPCB Part Class: Basic Part
C31 C32 = CL21C080DBANNNC: Supplier: LCSC; Supplier Part: C170111; Manufacturer: Samsung Electro-Mechanics; Contributor: LCSC; JLCPCB Part Class: Extended Part
L1 = FCM1005KF-601T03: Supplier: LCSC; Supplier Part: C427432; Manufacturer: TAI-TECH(台庆); Contributor: LCSC; JLCPCB Part Class: Extended Part
LED1 = SZYY0805B: Supplier: LCSC; Supplier Part: C434433; Manufacturer: yongyu(永裕光电); Contributor: LCSC; JLCPCB Part Class: Extended Part
R40 = ARG05FTC0500: Supplier: LCSC; Supplier Part: C2828866; Manufacturer: 光颉(Viking); JLCPCB Part Class: Extended Part; Contributor: LCSC
R19 R20 R47 R48 = RMC04025.1K5%N: Supplier: LCSC; Supplier Part: C325524; Manufacturer: Tyohm; Resistance (Ohms): 5.1K; Contributor: LCSC; JLCPCB Part Class: Extended Part
R16-R18 R27 R36 R64 = RMC08054.7K1%N: Supplier: LCSC; Supplier Part: C269746; Manufacturer: Tyohm; Resistance (Ohms): 4.7K; Contributor: LCSC; JLCPCB Part Class: Extended Part
SW1 = TS-3027-B: Supplier: LCSC; Supplier Part: C561482; Manufacturer: XKB Enterprise; Contributor: LCSC; JLCPCB Part Class: Extended Part
SW2 = MK-12C02-G025: Supplier: LCSC; Supplier Part: C778186; Manufacturer: G-Switch; Contributor: LCSC; JLCPCB Part Class: Extended Part
U1 = STM32H757IIT6: Supplier: LCSC; Supplier Part: C730215; Manufacturer: STMicroelectronics; Contributor: LCSC; JLCPCB Part Class: Extended Part
U22 = NUF2042XV6T1G: Supplier: LCSC; Supplier Part: C90707; Manufacturer: ON Semicon; Contributor: LCSC; JLCPCB Part Class: Extended Part
U10 U23 = USB-TYPE-C-017: Supplier: LCSC; Supplier Part: C2927037; Manufacturer: DEALON(德艺隆); link: https://atta.szlcsc.com/upload/public/pdf/source/20211217/653222EE5174722C9DFE2966329956D8.pdf; JLCPCB Part Class: Extended Part; Contributor: lcsc
U27 = A1257WR-S-11P: Supplier: LCSC; Supplier Part: C272991; Manufacturer: Changjiang Connectors; Contributor: LCSC; JLCPCB Part Class: Extended Part
X1 = CM315D32768DZFT: Supplier: LCSC; Supplier Part: C182057; Manufacturer: CITIZEN; Contributor: LCSC; JLCPCB Part Class: Extended Part
X2 = TZ1620C: Supplier: LCSC; Supplier Part: C498196; Manufacturer: TST; Contributor: LCSC; JLCPCB Part Class: Extended Part
C57 = 0805CG150J500NT: Supplier: LCSC; Manufacturer: FH; Supplier Part: C63339; JLCPCB Part Class: Extended Part
C66 = CC0805JRX7R9BB823: Supplier: LCSC; Supplier Part: C520047; Manufacturer: YAGEO; Contributor: LCSC; JLCPCB Part Class: Extended Part
C69 C76-C80 = CC0805KRX7R9BB103: Supplier: LCSC; Manufacturer: YAGEO; Supplier Part: C83170; JLCPCB Part Class: Extended Part
FPC1 = 0.5K-HX-24PWB: Supplier: LCSC; Supplier Part: C2919499; Manufacturer: HDGC(华德共创); Contributor: LCSC; JLCPCB Part Class: Extended Part
Q3 Q4 = S8050_C105433: Supplier: LCSC; Manufacturer: CJ; Manufacturer Part: S8050; Supplier Part: C105433; JLCPCB Part Class: Extended Part
R22 = AR05BTCW1004: Supplier: LCSC; Supplier Part: C316223; Manufacturer: Viking Tech; Resistance (Ohms): 1M; Contributor: LCSC; JLCPCB Part Class: Extended Part
R23 = ARG05FTC1691: Supplier: LCSC; Supplier Part: C218401; Manufacturer: Viking Tech; Resistance (Ohms): 1.69K; Contributor: LCSC; JLCPCB Part Class: Extended Part
R32 = ARG05FTC4001N: Supplier: LCSC; Supplier Part: C2828855; Manufacturer: 光颉(Viking); Contributor: LCSC; JLCPCB Part Class: Extended Part
R34 = AECR0805F36R0K9: Supplier: LCSC; Supplier Part: C352217; Manufacturer: ResistorToday; Resistance (Ohms): 36; Contributor: LCSC; JLCPCB Part Class: Extended Part
R35 = AC0805JR-0739RL: Supplier: LCSC; Supplier Part: C229199; Manufacturer: YAGEO; Contributor: LCSC; JLCPCB Part Class: Extended Part; Resistance: 39Ω
U8 = ME6211A12M3G-N: Supplier: LCSC; Supplier Part: C236678; Manufacturer: Nanjing Micro One Elec; Contributor: LCSC; JLCPCB Part Class: Extended Part
U9 = LY68L6400SLIT: Supplier: LCSC; Supplier Part: C261881; Manufacturer: Lyontek Inc.; Contributor: LCSC; JLCPCB Part Class: Extended Part
U11 = XC6206-2.8V: Supplier: LCSC; Supplier Part: C2892669; Manufacturer: YONGYUTAI(永裕泰); Contributor: LCSC; JLCPCB Part Class: Extended Part
U12 = CP2102-GMR: Supplier: LCSC; Manufacturer: SILICON LABS; Supplier Part: C6568; JLCPCB Part Class: Basic Part
U13 = ESP32-S(8MB): Supplier: LCSC; Supplier Part: C2991922; Manufacturer: Ai-Thinker(安信可); link: https://atta.szlcsc.com/upload/public/pdf/source/20211217/F4BEA33E732D6002D10DAED85BBCB52B.pdf; Contributor: lcsc; JLCPCB Part Class: Extended Part
U14 = MF-NSMF150-2: Supplier: LCSC; Manufacturer: BOURNS; Supplier Part: C89655; JLCPCB Part Class: Extended Part
U15 = 65K5.: Supplier: LCSC; Supplier Part: C841299; Manufacturer: Shenzhen Fuman Elec; Contributor: LCSC; JLCPCB Part Class: Extended Part
U16 = ADV7180BCP32Z-RL: Supplier: LCSC; Supplier Part: C459884; Manufacturer: Analog Devices; Contributor: LCSC; JLCPCB Part Class: Extended Part
X5 = 7B028636R01: Supplier: LCSC; Supplier Part: C655017; Manufacturer: HD; Contributor: LCSC; JLCPCB Part Class: Extended Part

## Nets
1.8V: C66.1 C67.2 C69.1 C72.1 C73.1 C74.1 C75.1 C76.2 C77.2 C78.1 C79.2 U15.2(VOUT) U16.14(DVDD) U16.18(PVDD) U16.22(AVDD) U16.30(DVDD)
3V3_ESP32: C41.2 C42.2 C52.1 C56.2 C58.2 C59.2 C61.2 C62.1 C70.1 C71.1 C80.2 C84.2 C86.2 C88.2 CARD2.4(VDD) CN22.2 FPC1.14 R4.1 R5.1 R6.1 R7.1 R8.1 R16.2 R17.2 R18.2 R21.2 R25.1 R26.1 R27.2 R32.1 R36.1 R39.1 R42.1 U8.3(VIN) U9.8(VCC) U11.3(VIN) U12.6(VDD) U13.2(3V3) U15.3(VIN) U16.3(DVDDIO) U20.1(VOUT)
3V3_MCU: C1.1 C2.2 C3.2 C4.2 C5.2 C6.2 C7.1 C8.2 C9.2 C10.2 C11.1 C12.2 C13.2 C14.2 C15.2 C16.2 C17.1 C18.2 C19.2 C22.2 C26.1 C36.2 C37.2 C38.2 C39.1 C40.1 C82.2 C89.2 C90.1 C92.1 C93.1 C95.2 L1.1 R2.2 R3.2 R41.1 R43.2 R44.1 R49.2 R50.2 R51.2 R52.2 R58.2 R88.2 SW2.1 U1.7(VDD) U1.8(VBAT) U1.13(VDD) U1.25(VDD) U1.44(VDD) U1.48(VDD) U1.65(VDD) U1.71(VDD) U1.82(VDDLDO) U1.84(VDD) U1.92(VDD) U1.99(VDD) U1.113(VDD) U1.120(VDD50USB) U1.121(VDD33USB) U1.126(VDD) U1.135(VDDLDO) U1.136(VDD) U1.152(VDD) U1.160(VDD) U1.174(PDR_ON) U1.175(VDDLDO) U1.176(VDD) U2.1(VDDIO) U2.10(VDD) U3.2(VDD) U3.4(S1) U3.13(VDDIO) U4.5(VDDIO) U4.8(VDD) U7.2(VREF1) U17.5(VIO) U19.1(VOUT) U21.5(VIO) U25.2(VCCA) U25.10(OE) U25.19(VCCB) U26.2(VCCA) U26.10(OE) U27.10 U29.2(VCCA) U29.10(OE) U29.19(VCCB)
5V_OUT: C20.1 C21.2 C27.1 C46.2 C47.2 C48.2 C96.2 CN1.1 CN2.1 CN3.1 CN4.1 CN5.1 CN6.1 CN7.1 CN8.1 CN9.1 CN10.1 CN11.1 CN14.10 CN16.1 CN19.3 CN20.1 CN21.1 CN22.1 CN24.1 R9.1 R10.1 R11.1 R12.1 R15.2 R89.1 R90.1 U5.4(VCC) U5.6(VCC) U5.18(AVCC) U6.3(DVDD) U6.19(RESET#) U6.21(AVDD) U6.24(PVDD) U17.3(VCC) U21.3(VCC) U24.1(OUT) U27.1
AGND: C1.2 C2.1 C3.1 C4.1 C5.1 C6.1 C7.2 C8.1 C9.1 C10.1 C11.2 C12.1 C13.1 C14.1 C15.1 C16.1 C17.2 C18.1 C19.1 C20.2 C21.1 C22.1 C23.1 C24.2 C25.1 C26.2 C27.2 C28.2 C29.1 C30.1 C31.1 C32.1 C33.1 C34.1 C36.1 C37.1 C38.1 C39.2 C40.2 C41.1 C42.1 C43.1 C44.1 C46.1 C47.1 C48.1 C52.2 C53.2 C54.1 C55.2 C56.1 C57.1 C58.1 C59.1 C60.1 C61.1 C62.2 C63.2 C64.1 C67.1 C70.2 C71.2 C72.2 C73.2 C74.2 C75.2 C76.1 C77.1 C78.2 C79.1 C80.1 C81.2 C82.1 C83.1 C84.1 C85.2 C86.1 C88.1 C89.1 C90.2 C91.1 C92.2 C93.2 C94.1 C95.1 C96.1 CARD2.6(VSS) CARD2.10(GND) CN1.7 CN1.8 CN1.9 CN2.7 CN2.8 CN2.9 CN3.6 CN3.7 CN3.8 CN4.6 CN4.7 CN4.8 CN5.6 CN5.7 CN5.8 CN6.4 CN6.5 CN6.6 CN7.4 CN7.5 CN7.6 CN8.4 CN8.5 CN8.6 CN9.4 CN9.5 CN9.6 CN10.4 CN10.5 CN10.6 CN11.4 CN11.5 CN11.6 CN14.1 CN14.11 CN14.12 CN15.5 CN15.6 CN15.7 CN15.8 CN16.10 CN16.11 CN16.12 CN17.5 CN17.6 CN17.7 CN17.8 CN18.1 CN18.4 CN18.5 CN19.1 CN19.4 CN19.5 CN20.5 CN20.6 CN20.7 CN21.3 CN21.4 CN21.5 CN22.5 CN22.6 CN22.7 CN24.8 CN24.9 CN24.10 D4.2 D5.2 D6.2 D7.2 D8.2 D9.2 D10.2 D11.2 D12.2 D13.2 D15.2 D16.2 D17.2 D18.2 D19.2 D20.2 D21.2 D22.2 D23.2 D24.2 D25.2 D26.2 D27.2 D28.2 D29.2 D30.2 D31.2 D32.2 D33.2 D34.2 D35.2 D36.2 D37.2 D38.2 D39.2 D40.2 D41.2 D42.2 D43.2 D44.2 D45.2 D46.2 D47.2 D48.2 D49.2 D50.2 D51.2 D52.2 D53.2 D54.2 D55.2 D56.2 D57.2 D58.2 D59.2 D60.2 D61.2 D62.2 D63.2 D64.2 D65.2 FPC1.10 FPC1.23 FPC1.25 FPC1.26 LED1.2(-) R14.1 R19.2 R20.2 R24.2 R33.1 R35.1 R47.2 R48.2 R63.1 R93.1 SW1.2 SW1.4 SW2.3 SW2.4 SW2.5 SW2.6 SW2.7 U1.6(VSS) U1.12(VSS) U1.14(VSSSMPS) U1.24(VSS) U1.38(VSSA) U1.45(VSS) U1.47(VSS) U1.64(VSS) U1.70(VSS) U1.81(VSS) U1.83(VSS) U1.93(VSS) U1.100(VSS) U1.105(VSSDSI) U1.109(VSSDSI) U1.112(VSS) U1.119(VSS) U1.134(VSS) U1.137(VSS) U1.151(VSS) U1.159(VSS) U1.173(VSS) U2.3(VSS) U2.8(VSS) U2.9(VSS) U3.9(GND) U3.11(GND) U4.2(SDx) U4.3(SCx) U4.6(GND) U4.7(GND) U5.3(GND) U5.5(GND) U5.21(GND) U6.4(DGND) U6.20(AGND) U6.23(PGND) U6.29(EP) U7.1(GND) U8.1(VSS) U9.4(VSS) U10.1 U10.2 U10.3 U10.4 U10.A1B12(GND) U10.B1A12(GND) U11.1(VSS) U12.3(GND) U12.29(EP) U13.1(GND) U13.15(GND) U13.38(GND) U13.39(EP) U15.1(VSS) U16.2(DGND) U16.29(DGND) U16.33(EP) U17.2(GND) U17.9(EP) U19.4(GND) U19.9(EP) U20.4(GND) U20.9(EP) U21.2(GND) U21.9(EP) U22.2(GND) U23.1 U23.2 U23.3 U23.4 U23.A1B12(GND) U23.B1A12(GND) U24.5(GND) U24.7(EP) U25.11(GND) U25.21(EP) U26.11(GND) U26.21(EP) U27.11 U27.12 U27.13 U29.11(GND) U29.21(EP) X2.2(GND) X2.4(GND) X3.2(GND) X3.4(GND) X4.2(GND) X4.4(GND) X5.2(GND) X5.4(GND)
VBUS_ESP: D64.1 U10.A4B9(VBUS) U10.B4A9(VBUS) U14.1
VBUS_ESP32: R62.1 U12.8(VBUS) U14.2
VBUS_STM32: D3.2(A) R64.2 U22.5(VBUS) U23.A4B9(VBUS) U23.B4A9(VBUS)
VDDA: C24.1 C28.1 L1.2 R40.1 U1.40(VDDA)
VIN: C81.1 C83.2 C94.2 D1.1(C) D3.1(C) D14.1(C) R37.2 R38.2 R92.1 U19.8(VIN) U20.8(VIN) U24.6(IN)
ADC1_3V3: CN24.6 D33.1 U1.29(PF9)
ADC2_3V3: CN24.7 D34.1 U1.23(PF5)
AIN1: C68.1 U16.19(AIN1)
BOOT0: R1.1 U1.167(BOOT0)
C1: R47.1 U23.A5(CC1)
C2: R48.1 U23.B5(CC2)
CAM_RST: C53.1 FPC1.19 R18.1
CAN1_RX: U1.143(PD0) U21.4(RXD)
CAN1_SILENT: R43.1 U1.115(PG5) U21.8(S)
CAN1_TX: U1.144(PD1) U21.1(TXD)
CAN2_RX: U1.85(PB12) U17.4(RXD)
CAN2_SILENT: R44.2 U1.114(PG4) U17.8(S)
CAN2_TX: U1.86(PB13) U17.1(TXD)
CAN_H_1: CN8.2 D7.1 R46.2 U21.7(CANH)
CAN_H_2: CN9.2 D9.1 R45.1 U17.7(CANH)
CAN_L_1: CN8.3 D6.1 R65.1 U21.6(CANL)
CAN_L_2: CN9.3 D8.1 R86.1 U17.6(CANL)
CAP1: CN24.2 D29.1 U1.73(PE11)
CAP2: CN24.3 D30.1 U1.69(PE9)
CAP3: CN24.4 D31.1 U1.28(PF8)
CAP4: CN24.5 D32.1 U1.76(PE14)
CC1: R20.1 U10.A5(CC1)
CC2: R19.1 U10.B5(CC2)
CD_SD: CARD2.9(CD) D59.1 R39.2 U1.127(PA8)
CLK_OSD: U5.17(PB5(SCK/PCINT5)) U6.10(SCLK)
CLKIN: U6.5(CLKIN) X4.3(OSC2)
CS_IMU: U1.154(PG10) U4.12(CS)
CS_OSD: U5.10((PCINT22/OC0A/AIN0)PD6) U6.8(CS#)
CSI_1.2V: C60.2 FPC1.15 U8.2(VOUT)
CSI_2.8V: C54.2 C55.1 FPC1.21 U11.2(VOUT)
CSI_D0: FPC1.6 U13.29(IO5) U16.16(P0)
CSI_D1: FPC1.4 U13.30(IO18) U16.15(P1)
CSI_D2: FPC1.3 U13.31(IO19) U16.10(P2)
CSI_D3: FPC1.5 U13.33(IO21) U16.9(P3)
CSI_D4: FPC1.7 U13.4(SENSOR_VP) U16.8(P4)
CSI_D5: FPC1.9 U13.5(SENSOR_VN) U16.7(P5)
CSI_D6: FPC1.11 U13.6(IO34) U16.6(P6)
CSI_D7: FPC1.13 U13.7(IO35) U16.5(P7)
CSI_HSYNC: FPC1.16 U13.37(IO23) U16.1(HS)
CSI_MCLK: FPC1.12 Q3.3 R25.2 U13.25(IO0)
CSI_PCLK: C57.2 FPC1.8 U13.36(IO22) U16.11(LLC)
CSI_VSYNC: FPC1.18 U13.10(IO25) U16.31(VS/FIELD)
CURRENT_SENSE_1: CN17.3 D63.1 U1.53(PC4)
CURRENT_SENSE_2: CN15.3 D61.1 U1.60(PF13)
D+: D15.1 U10.A6(DP1) U10.B6(DP2) U12.4(D+)
D-: D65.1 U10.A7(DN1) U10.B7(DN2) U12.5(D-)
DEBUG_RX_STM32: U1.42(PA1) U27.2
DEBUG_TX_STM32: U1.41(PA0) U27.3
DTR: Q3.2 R31.1 U12.28(DTR)
ESP32_EN: Q4.3 R26.2 U13.3(EN)
FAULT_5V: R41.2 U1.110(PG2) U24.3(FAULT#)
HSYNC: R12.2 U5.25(PC2(ADC2/PCINT10)) U6.18(HSYNC#)
I2C_2_SCL: R49.1 R53.1 U1.19(PF1)
I2C_2_SDA: R50.1 R54.2 U1.18(PF0)
I2C_4_SCL: R52.1 R55.1 U1.61(PF14)
I2C_4_SDA: R51.1 R56.1 U1.62(PF15)
I2C_SCL_COMPASS: R2.1 U1.168(PB8) U3.1(SCL)
I2C_SDA_COMPASS: R3.1 U1.169(PB9) U3.16(SDA)
INTRQ_ADV7180: U13.8(IO32) U16.32(INTRQ#)
IO1: CN5.2 D28.1 U1.116(PG6)
IO1_AUX: CN14.6 D35.1 U5.11((PCINT23/AIN1)PD7)
IO2: CN5.3 D27.1 U1.122(PC6)
IO2_AUX: CN14.7 D36.1 U5.24(PC1(ADC1/PCINT9))
IO3: CN5.4 D26.1 U1.49(PA4)
IO3_AUX: CN14.8 D37.1 U5.28(PC5(ADC5/SCL/PCINT13))
IO4: CN5.5 D25.1 U1.21(PF3)
IO4_AUX: CN14.9 D38.1 U5.27(PC4(ADC4/SDA/PCINT12))
IO16: R21.1 U9.1(CE#) U13.27(IO16)
JTCK/SWCLK: U1.138(PA14) U27.5
JTDI: U1.139(PA15) U27.6
JTDO: U1.162(PB3) U27.7
JTMS/SWDIO: U1.132(PA13) U27.4
LOS: R10.2 U5.12((PCINT0/CLKO/ICP1)PB0) U6.12(LOS)
MISO_OSD: U5.16((PCINT4/MISO)PB4) U6.11(SDOUT)
MOSI_OSD: U5.15((PCINT3/OC2A/MOSI)PB3) U6.9(SDIN)
NJTRST: U1.163(PB4) U27.8
NRST: C33.2 SW1.1 SW1.3 U1.33(NRST) U27.9
PC14-OSC32_IN: C29.2 U1.10(PC14-OSC32_IN) X1.2(OSC2)
PC15-OSC32_OUT: C30.2 U1.11(PC15-OSC32_OUT) X1.1(OSC1)
PH0-OSC_IN: C31.2 U1.31(PH0-OSC_IN) X2.1
PH1-OSC_OUT: C32.2 U1.32(PH1-OSC_OUT) X2.3
POWER_BRICK1_5V: CN17.1 CN17.2 D1.2(A)
POWER_BRICK2_5V: CN15.1 CN15.2 D14.2(A) R91.1
PPM: CN21.2 D24.1 U1.75(PE13)
PSRAM_CLK: U9.6(SCLK) U13.28(IO17)
PWM1: U1.50(PA5) U26.9(A8)
PWM2: U1.52(PA7) U26.8(A7)
PWM3: U1.96(PD13) U26.7(A6)
PWM4: U1.46(PA3) U26.6(A5)
PWM5: U1.43(PA2) U26.5(A4)
PWM6: U1.55(PB0) U26.4(A3)
PWM7: U1.97(PD14) U26.3(A2)
PWM8: U1.56(PB1) U26.1(A1)
PWM_1_AUX: R57.1 U5.1((PCINT19/OC2B/INT1)PD3)
PWM_1_FMU: R66.1 U26.12(B8)
PWM_2_AUX: R59.1 U5.9((PCINT21/OC0B/T1)PD5)
PWM_2_FMU: R67.1 U26.13(B7)
PWM_3_AUX: R60.1 U5.14((PCINT2/SS#/OC1B)PB2)
PWM_3_FMU: R68.1 U26.14(B6)
PWM_4_AUX: R61.1 U5.13((PCINT1/OC1A)PB1)
PWM_4_FMU: R69.1 U26.15(B5)
PWM_5_FMU: R70.1 U26.16(B4)
PWM_6_FMU: R71.1 U26.17(B3)
PWM_7_FMU: R72.1 U26.18(B2)
PWM_8_FMU: R73.1 U26.20(B1)
RESET#: C45.1 R9.2 U5.29(PC6(RESET#/PCINT14))
RESET_ADV7180: R36.2 U13.26(IO4) U16.25(RESET#)
RSSI: CN22.4 D23.1 U1.37(PC3_C)
RTS: Q4.2 R30.1 U12.24(RTS)
RX_debug_atmega328: CN20.3 U5.30(PD0(RXD/PCINT16)) U7.5(SDA2)
RX_OSD: U1.165(PB6) U7.4(SDA1)
SBUS/IBUS: CN22.3 D22.1 U1.123(PC7)
SD1: U9.5(SI/SIO[0]) U13.22(SDI)
SD2: U9.7(SIO[3]) U13.17(SHD/SD2)
SD3: U9.3(SIO[2]) U13.18(SWP/SD3)
SDMMC1_0: CARD2.7(DATA0) D52.1 R7.2 U1.124(PC8)
SDMMC1_1: CARD2.8(DATA1) D53.1 R8.2 U1.125(PC9)
SDMMC1_2: CARD2.1(DATA2) D56.1 R4.2 U1.140(PC10)
SDMMC1_3: CARD2.2(CD/DATA3) D55.1 R5.2 U1.141(PC11)
SDMMC1_CLK: CARD2.5(CLK) D51.1 U1.142(PC12)
SDMMC1_CMD: CARD2.3(CMD) D54.1 R6.2 U1.145(PD2)
SDO: U9.2(SO/SIO[1]) U13.21(SDO)
SFL: U13.19(SCS/CMD) U16.4(SFL)
SPI4_CS1: CN1.5 D4.4 U1.2(PE3)
SPI4_CS2: CN1.6 D4.3 U1.3(PE4)
SPI4_MISO: CN1.4 D4.5 U1.4(PE5)
SPI4_MOSI: CN1.3 D4.6 U1.5(PE6)
SPI4_SCK: CN1.2 D4.1 U1.1(PE2)
SPI6_CS1: CN2.5 D5.4 U1.161(PG15)
SPI6_CS2: CN2.6 D5.3 U1.118(PG8)
SPI6_MISO: CN2.4 D5.5 U1.156(PG12)
SPI6_MOSI: CN2.3 D5.6 U1.158(PG14)
SPI6_SCK: CN2.2 D5.1 U1.157(PG13)
SPI_CS_BARO: U1.34(PC0) U2.6(CSB)
SPI_SCK_BARO: U1.78(PB10) U2.2(SCK)
SPI_SCL_IMU: U1.155(PG11) U4.13(SCL)
SPI_SDI_BARO: U1.35(PC1) U2.4(SDI)
SPI_SDI_IMU: U1.150(PD7) U4.14(SDA)
SPI_SDO_BARO: U1.36(PC2_C) U2.5(SDO)
SPI_SDO_IMU: U1.153(PG9) U4.1(SDO/SA0)
STM32_DN: U1.130(PA11) U22.4(D2(0)) U23.A7(DN1) U23.B7(DN2)
STM32_DP: U1.131(PA12) U22.6(D1(0)) U23.A6(DP1) U23.B6(DP2)
TWI_SCK: FPC1.20 R17.1 U13.12(IO27) U16.28(SCLK)
TWI_SDA: FPC1.22 R16.1 U13.11(IO26) U16.27(SDATA)
TX_debug_atmega328: CN20.2 U5.31(PD1(TXD/PCINT17)) U7.6(SCL2)
TX_OSD: U1.164(PB5) U7.3(SCL1)
U0RX_ESP32: R28.1 U13.34(U0RXD)
U0TX_ESP32: R29.1 U13.35(U0TXD)
U2RX_ESP32: U1.27(PF7) U13.23(IO15)
U2TX_ESP32: U1.26(PF6) U13.24(IO2)
UART1_RX: U1.88(PB15) U29.4(A3)
UART1_RX_PORT: R83.1 U29.17(B3)
UART1_TX: U1.87(PB14) U29.3(A2)
UART1_TX_PORT: R82.1 U29.18(B2)
UART2_CTS: U1.146(PD3) U25.8(A7)
UART2_CTS_PORT: R80.1 U25.13(B7)
UART2_RTS: U1.147(PD4) U25.9(A8)
UART2_RTS_PORT: R81.1 U25.12(B8)
UART2_RX: U1.149(PD6) U25.7(A6)
UART2_RX_PORT: R79.1 U25.14(B6)
UART2_TX: U1.148(PD5) U25.6(A5)
UART2_TX_PORT: R78.1 U25.15(B5)
UART3_CTS: U1.94(PD11) U25.5(A4)
UART3_CTS_PORT: R76.1 U25.16(B4)
UART3_RTS: U1.95(PD12) U25.1(A1)
UART3_RTS_PORT: R77.1 U25.20(B1)
UART3_RX: U1.79(PB11) U25.3(A2)
UART3_RX_PORT: R75.1 U25.18(B2)
UART3_TX: U1.89(PD8) U25.4(A3)
UART3_TX_PORT: R74.1 U25.17(B3)
UART8_RX: U1.170(PE0) U29.5(A4)
UART8_RX_PORT: R85.1 U29.16(B4)
UART8_TX: U1.171(PE1) U29.6(A5)
UART8_TX_PORT: R84.1 U29.15(B5)
VCAP_1: C23.2 C25.2 U1.80(VCAP) U1.133(VCAP) U1.172(VCAP)
Video_IN: C51.2 CN19.2 D58.1 R14.2
Video_OUT: CN18.2 D57.1 R13.2 R34.2
VOLTAGE_SENSE_1: CN17.4 D62.1 U1.51(PA6)
VOLTAGE_SENSE_2: CN15.4 D60.1 U1.58(PF11)
VSYNC: R11.2 U5.32(PD2(INT0/PCINT18)) U6.17(VSYNC#)
XFB: U6.6(XFB) X4.1(OSC1)
XTAL: C63.1 R22.2 U16.13(XTAL) X5.1
XTAL1: C64.2 R22.1 U16.12(XTAL1) X5.3
Net-(C34-2): C34.2 U3.10(C1)
Net-(C35-1): C35.1 U3.12(SETC)
Net-(C35-2): C35.2 U3.8(SETP)
Net-(C43-2): C43.2 U5.8((PCINT7/XTAL2/TOSC2)PB7) X3.1(OSC1)
Net-(C44-2): C44.2 U5.7((PCINT6/XTAL1/TOSC1)PB6) X3.3(OSC2)
Net-(C45-2): C45.2 CN20.4
Net-(C49-1): C49.1 U6.26(VOUT)
Net-(C49-2): C49.2 C50.2 R13.1
Net-(C50-1): C50.1 U6.25(SAG)
Net-(C51-1): C51.1 U6.22(VIN)
Net-(C65-1): C65.1 U16.20(VREFP)
Net-(C65-2): C65.2 U16.21(VREFN)
Net-(C66-2): C66.2 R23.1
Net-(C68-2): C68.2 R34.1 R35.2
Net-(C69-2): C69.2 R23.2 U16.17(ELPF)
Net-(C85-1): C85.1 R15.1 U7.7(VREF2) U7.8(EN)
Net-(C91-2): C91.2 R88.1 R89.2 U26.19(VCCB)
Net-(CN3-2): CN3.2 D17.1 R78.2
Net-(CN3-3): CN3.3 D17.5 R79.2
Net-(CN3-4): CN3.4 D17.4 R80.2
Net-(CN3-5): CN3.5 D17.3 R81.2
Net-(CN4-2): CN4.2 D16.1 R74.2
Net-(CN4-3): CN4.3 D16.5 R75.2
Net-(CN4-4): CN4.4 D16.4 R76.2
Net-(CN4-5): CN4.5 D16.3 R77.2
Net-(CN6-2): CN6.2 D20.1 R84.2
Net-(CN6-3): CN6.3 D21.1 R85.2
Net-(CN7-2): CN7.2 D19.1 R82.2
Net-(CN7-3): CN7.3 D18.1 R83.2
Net-(CN10-2): CN10.2 D11.1 R53.2
Net-(CN10-3): CN10.3 D10.1 R54.1
Net-(CN11-2): CN11.2 D13.1 R55.2
Net-(CN11-3): CN11.3 D12.1 R56.2
Net-(CN14-2): CN14.2 D39.1 R57.2
Net-(CN14-3): CN14.3 D40.1 R59.2
Net-(CN14-4): CN14.4 D41.1 R60.2
Net-(CN14-5): CN14.5 D42.1 R61.2
Net-(CN16-2): CN16.2 D43.1 R66.2
Net-(CN16-3): CN16.3 D44.1 R67.2
Net-(CN16-4): CN16.4 D45.1 R68.2
Net-(CN16-5): CN16.5 D46.1 R69.2
Net-(CN16-6): CN16.6 D47.1 R70.2
Net-(CN16-7): CN16.7 D48.1 R71.2
Net-(CN16-8): CN16.8 D49.1 R72.2
Net-(CN16-9): CN16.9 D50.1 R73.2
Net-(CN18-3): CN18.3 R90.2 R91.2
Net-(FPC1-17): FPC1.17 R24.1
Net-(LED1-1): LED1.1(+) R58.1
Net-(Q3-1): Q3.1 R30.2
Net-(Q4-1): Q4.1 R31.2
Net-(R1-2): R1.2 SW2.2
Net-(R27-1): R27.1 U12.9(RST#)
Net-(R28-2): R28.2 U12.26(TXD)
Net-(R29-2): R29.2 U12.25(RXD)
Net-(R32-2): R32.2 R33.2 U16.26(ALSB)
Net-(R37-1): R37.1 U19.2(ON/OFF#)
Net-(R38-1): R38.1 U20.2(ON/OFF#)
Net-(R40-2): R40.2 U1.39(VREF+)
Net-(R42-2): R42.2 R62.2 U12.7(REGIN)
Net-(R45-2): R45.2 R86.2
Net-(R46-1): R46.1 R65.2
Net-(R63-2): R63.2 R64.1 U1.128(PA9)
Net-(R92-2): R92.2 U24.4(EN)
Net-(R93-2): R93.2 U24.2(ILIM)

Not connected (* = marked no-connect by the designer): FPC1 1* 2* 24*; U1 9(PC13)* 15(VLXSMPS)* 16(VDDSMPS)* 17(VFBSMPs)* 20(PF2)* 22(PF4)* 30(PF10)* 54(PC5)* 57(PB2)* 59(PF12)* 63(PG0)* 66(PG1)* 67(PE7)* 68(PE8)* 72(PE10)* 74(PE12)* 77(PE15)* 90(PD9)* 91(PD10)* 98(PD15)* 101(VCAPDSI)* 102(VDD12DSI)* 103(DSI_D0P)* 104(DSI_D0N)* 106(DSI_CKP)* 107(DSI_CKN)* 108(VDD12DSI)* 111(PG3)* 117(PG7)* 129(PA10)* 166(PB7)*; U2 7(INT)*; U3 3(NC)* 5(NC)* 6(NC)* 7(NC)* 14(NC)* 15(DRDY)*; U4 4(INT1)* 9(INT2)* 10(OCS_Aux)* 11(SDO_Aux)*; U5 2((PCINT20/XCK/T0)PD4)* 19(ADC6)* 20(AREF)* 22(ADC7)* 23(PC0(ADC0/PCINT8))* 26(PC3(ADC3/PCINT11))*; U6 1(NC)* 2(NC)* 7(CLKOUT)* 13(SYNC_IN)* 14(NC)* 15(NC)* 16(NC)* 27(NC)* 28(NC)*; U10 A8(SBU1)* B8(SBU2)*; U12 1(DCD)* 2(RI)* 10(NC)* 11(SUSPEND#)* 12(SUSPEND)* 13(NC)* 14(NC)* 15(NC)* 16(NC)* 17(NC)* 18(NC)* 19(NC)* 20(NC)* 21(NC)* 22(NC)* 23(CTS)* 27(DSR)*; U13 9(IO33)* 13(IO14)* 14(IO12)* 16(IO13)* 20(SCK/CLK)* 32(NC)*; U16 23(AIN2)* 24(AIN3)*; U19 3(NC)* 5(NC)* 6(NC)* 7(NC)*; U20 3(NC)* 5(NC)* 6(NC)* 7(NC)*; U22 1(D1(i))* 3(D2(i))*; U23 A8(SBU1)* B8(SBU2)*; U29 1(A1)* 7(A6)* 8(A7)* 9(A8)* 12(B8)* 13(B7)* 14(B6)* 20(B1)*

## Notes on the sheets
sheet 1
- Low Speed Oscillator
- Reset & Boot Circuit
- High Speed Oscillator
- C = 2*(Cl-Cs)
- STM32 Debug
- USB
- decoupling capacitors
- Aladdin FC
sheet 2
- Magnetometer
- IMU
- Barometer
- SD Card
- Aladdin FC
sheet 3
- Atmega328
- OSD
- Level shifter
- Atmega328 debugging
- Connectors
- Camera Connector
- Video Transmitter Connector
- Aladdin FC
sheet 4
- CAN Bus 1
- CAN Bus 2
- I2C_2
- I2C_4
- SPI_1
- SPI_2
- Atmega328_PWM_AUX
- Analogic_Port
- I/O_PORT
- PPM Port
- RC Input
- UART Port 4
- UART Port 1
- STM32_PWM_FMU
- UART Port 3
- UART Port 2
- Aladdin FC
sheet 5
- ESP32-S
- OV2640 Camera
- Camera Connector
- ADV7180
- decoupling capacitors
- USB & CP2102
- PSRAM
- Aladdin FC
sheet 6
- Power Management
- 80.6K
- CAN Bus
- Power Connector
- POWER_BRICK_1
- POWER_BRICK_2
- Aladdin FC
